# EAGLE board STEP800_r1_0_0 (EAGLE 9.6.2), part 1 of 3
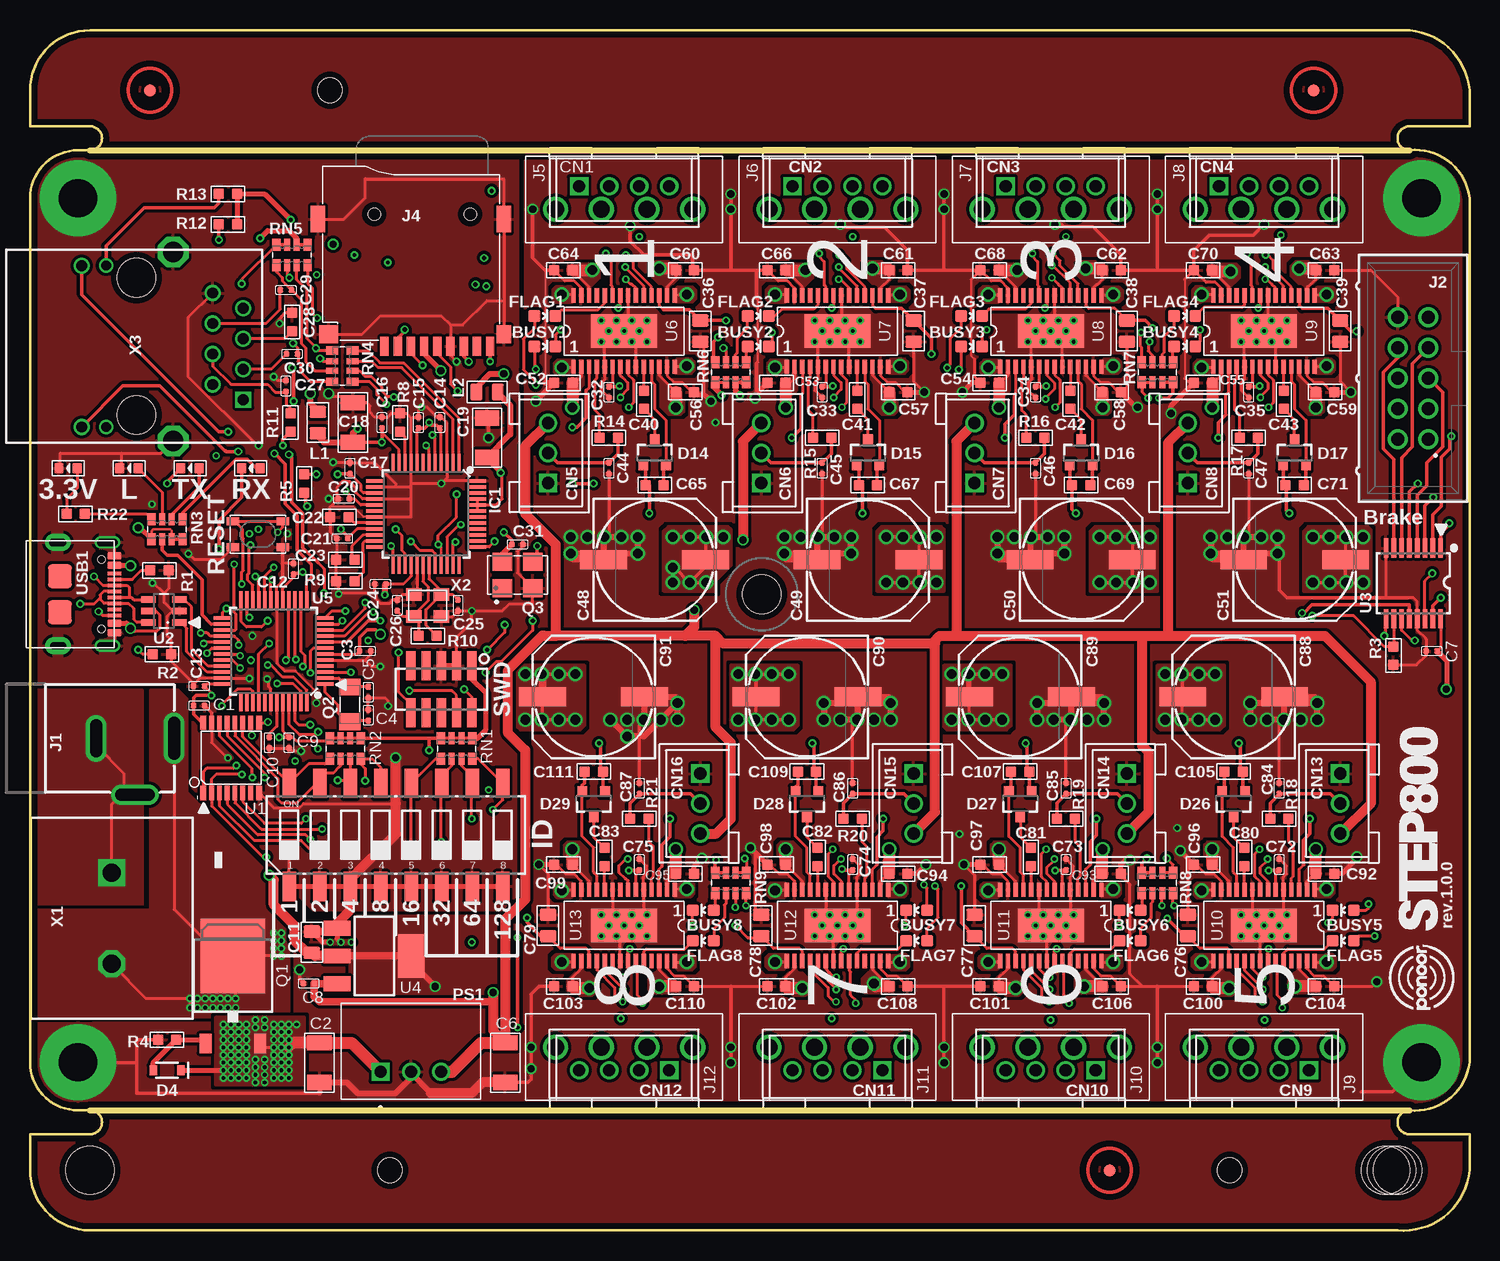
[diagram p3: board, top side]
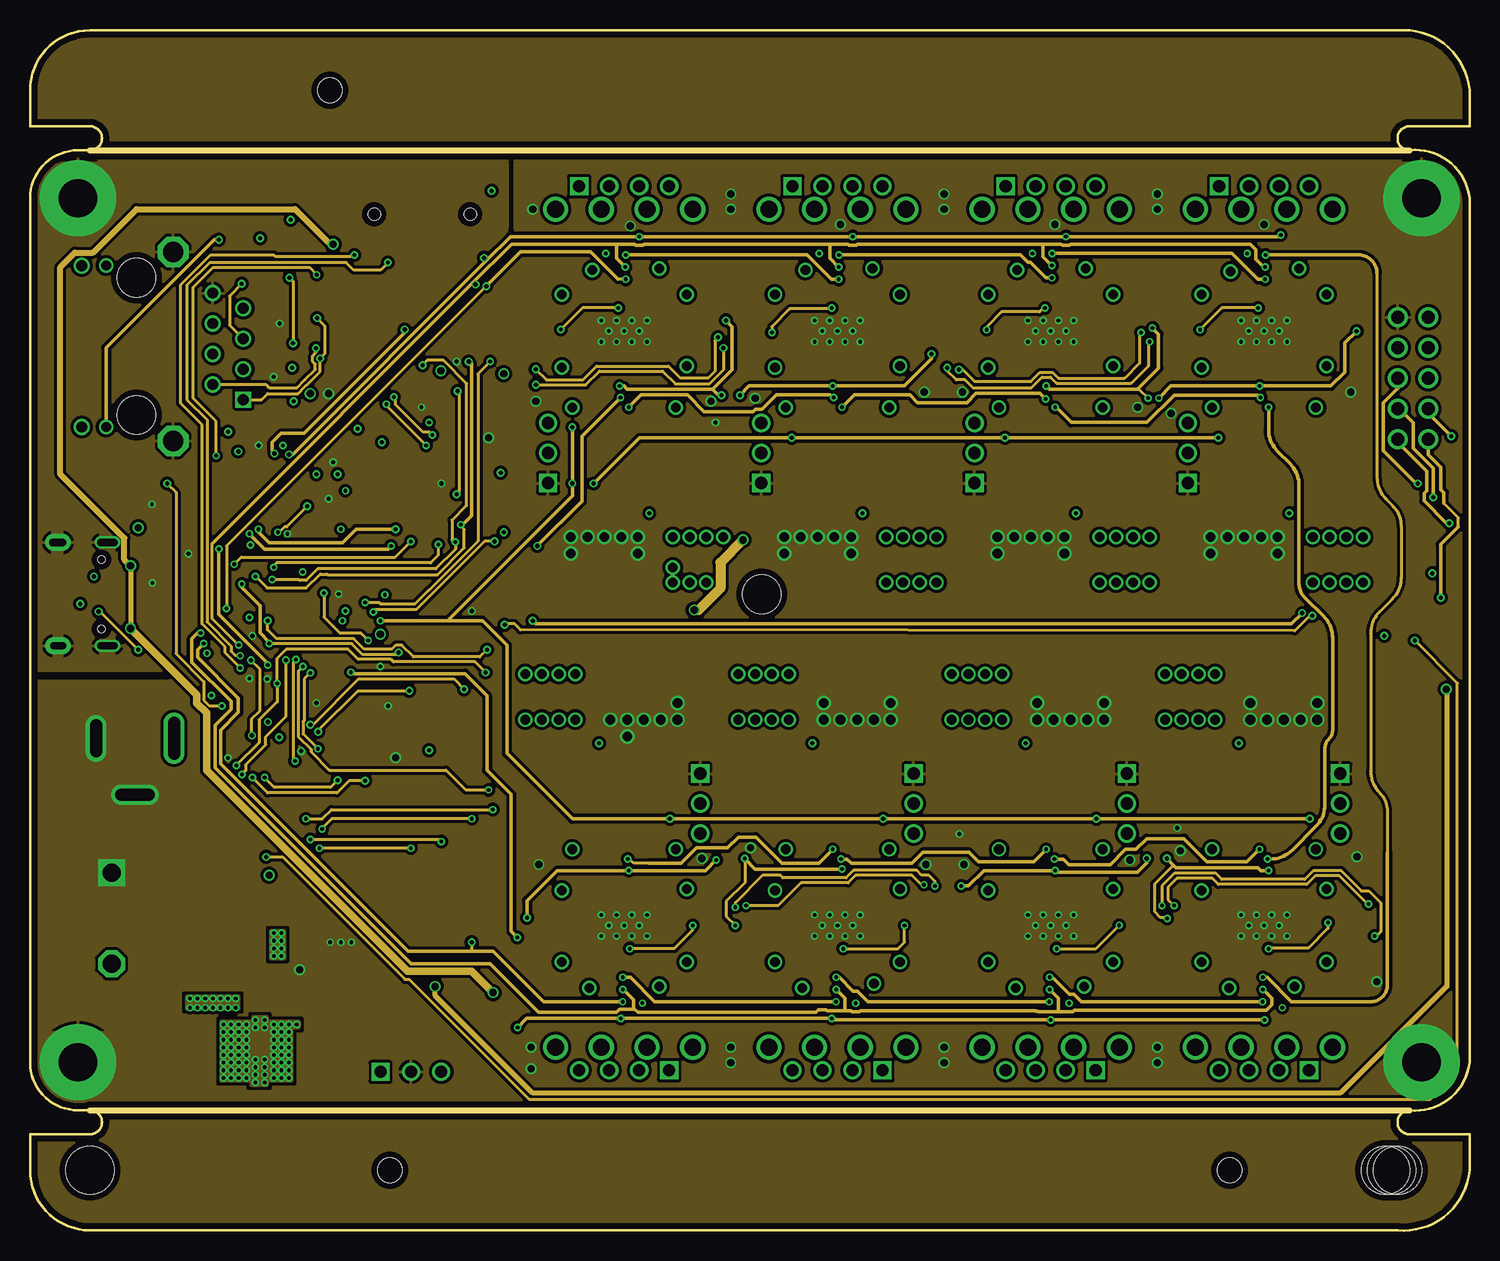
[diagram p4: board, inner layer Route2]
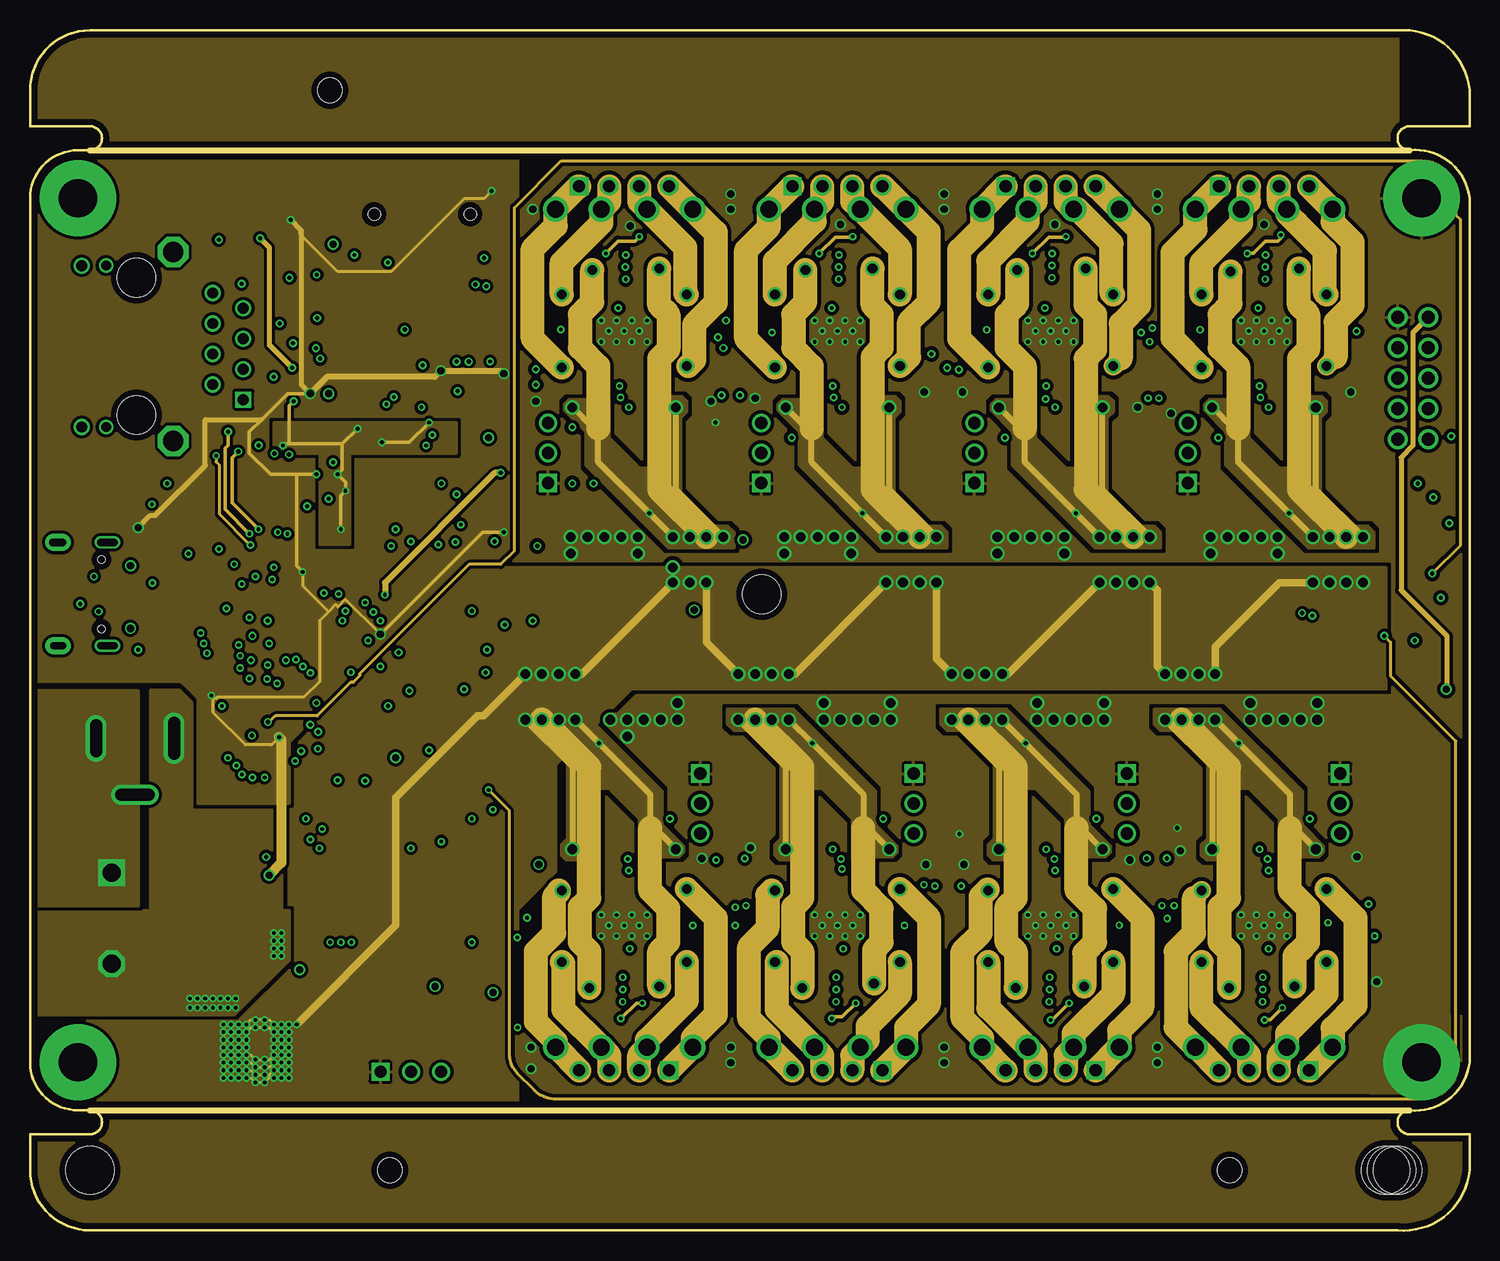
[diagram p5: board, inner layer Route15]
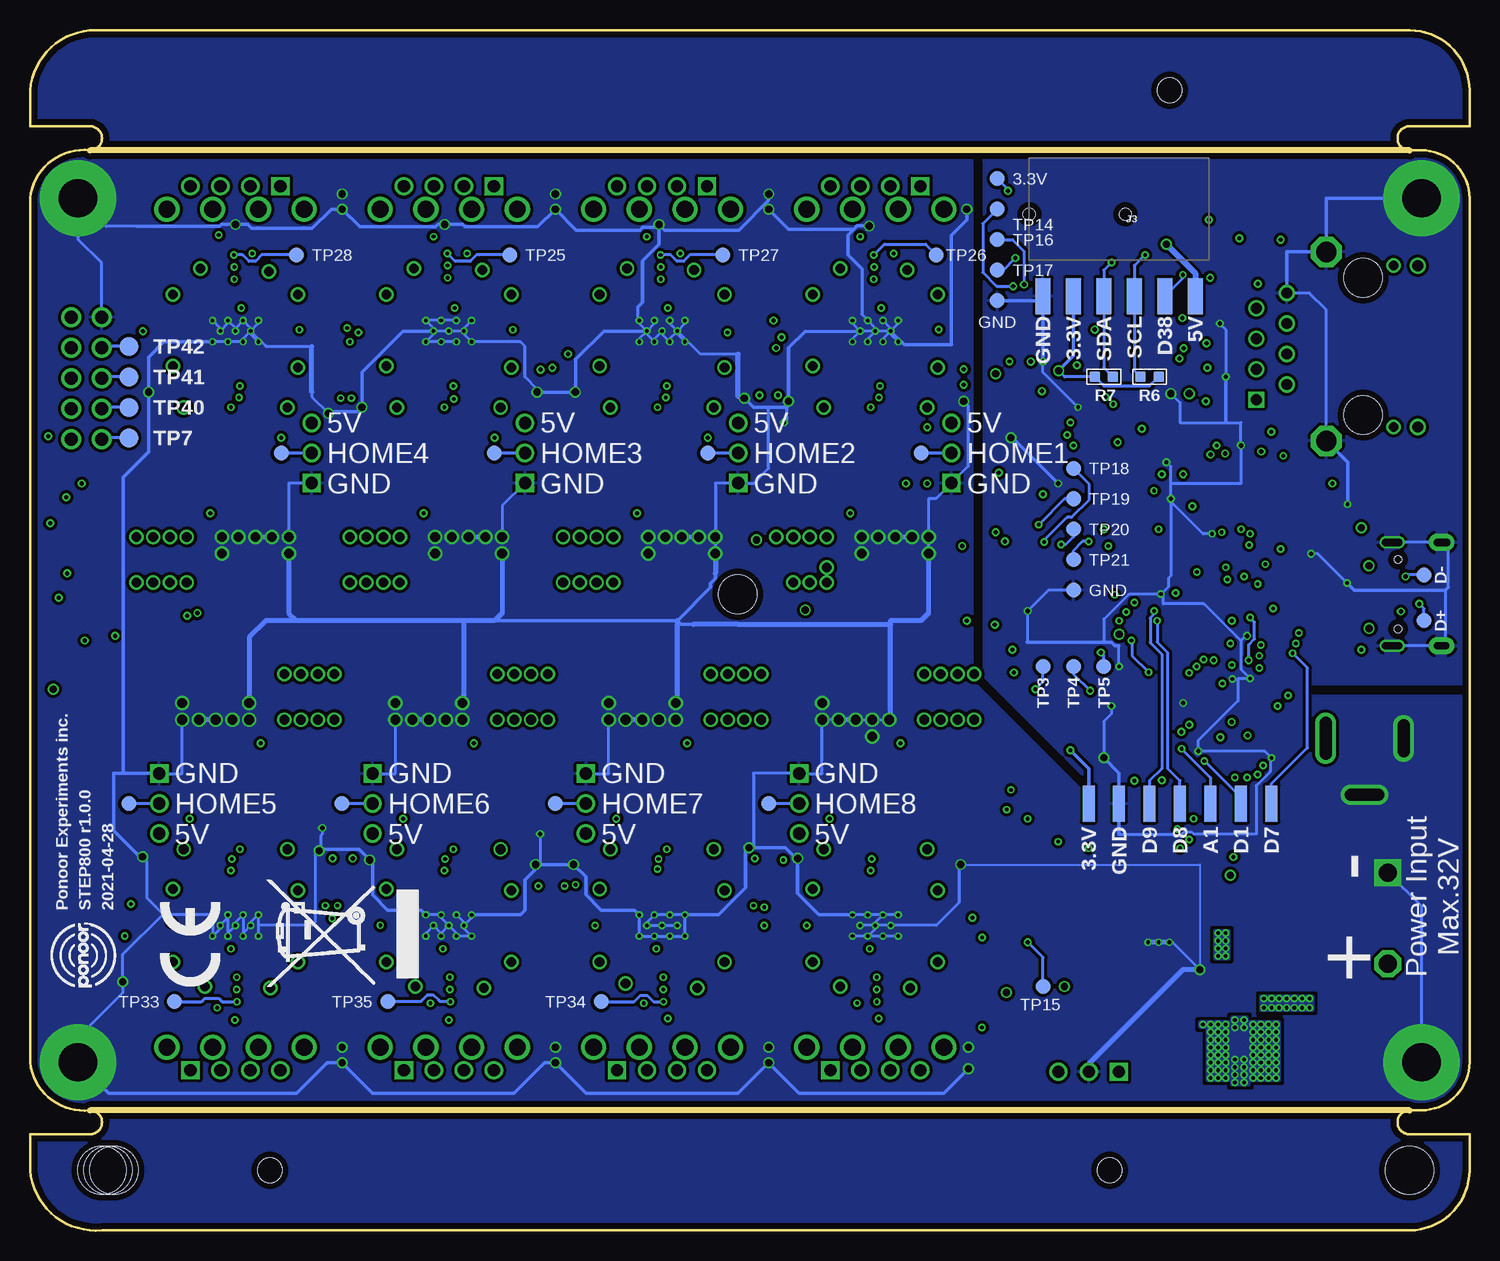
[diagram p6: board, bottom side, seen from below]

Size 120 x 100.05 mm. Coordinates in mm from the lower left corner, seen from the top.
Outline: 5,90.02 115,90.02
Outline: 5,10.02 115,10.02
Outline: 115,10.02 arc90 120,14.02 120,86.02 arc90 115,90.02
Outline: 5,90.02 arc90 6,91.02 arc90 5,92.02 0,92.02 0,95.02 arc-90 5,100.02 114,100.02 arc-90 120,95.02 120,92.02 115,92.02 arc90 114,91.02 arc90 115,90.02
Outline: 5,90.02 4,90.02 arc90 0,86.02 0,14.02 arc90 4,10.02 5,10.02
Outline: 5,10.02 arc-90 6,9.02 arc-90 5,8.02 0,8.02 0,5.02 arc90 5,0.02 114,0.02 arc90 120,5.02 120,8.02 115,8.02 arc-90 114,9.02 arc-90 115,10.02
Copper layers (1+2*15+16): Top 0.035mm / dielectric 1.6mm / Route2 0.035mm / dielectric 1.2mm / Route15 0.035mm / dielectric 0.2mm / Bottom 0.035mm
Design rules "PcbGoGo_4-layer_PCB_eagle_rule": minimum track width 6mil, minimum drill 12mil, track to track 6mil, track to pad 6mil, pad to pad 6mil, via to via 8mil, smd to smd 0mil, copper to edge 20mil, drill to drill 10mil, minimum pad ring 6mil, minimum via ring 6mil, stop-mask expansion 0mil, vias tented up to drill 100mil, thermal gap 10mil
Holes 2.05 mm at 25,95.02 100,5.02 30,5.02
Holes 4 mm at 5,5.02 114,5.02 113,5.02 113.5,5.02
Holes 3.2 mm at 61,53.02
tRestrict: area 8.3,93.3 to 11.7,96.7; area 88.3,3.3 to 91.7,6.7; area 105.3,93.3 to 108.7,96.7
bRestrict: 3 lines

## Footprints (pad centres in the part's own frame; a part is rotated, then mirrored left to right if it is on the bottom)
LED-0603 = smd 0.762 x 0.889: + -0.762,0; - 0.762,0
LED-0603' = smd 1 x 1: A 0,-0.877; C 0,0.877
C0402 = smd 0.5 x 0.5: 1 0,0.463; 2 0,-0.463
C1206 = smd 1.27 x 2.032: 1 -1.651,0; 2 1.651,0
C0805 = smd 1.397 x 1.016: 1 0,0.889; 2 0,-0.889
C0603 = smd 0.889 x 0.889: 1 0,0.762; 2 0,-0.762
NICHICON_D10 = smd 3.9 x 1.6: + 4.25,0; - -4.25,0
B4B-XASK-1 = drill 1.016 square: 1 -3.75,0 | drill 1.016: 2 -1.25,0; 3 1.25,0; 4 3.75,0
B3B-XASK-1 = drill 1.016 square: 1 -2.5,0 | drill 1.016: 2 0,0; 3 2.5,0
SOD-323 = smd 0.63 x 0.83: A 1.15,0; C -1.15,0
SOT23-3 = smd 0.8 x 0.9: 1 -0.95,-1; 2 0.95,-1; 3 0,1.1
FIDUCIAL-1X2 = smd 1 x 1: 1 0,0
TQFP48-LONG = smd 1.5 x 0.28: 1 -4.25,2.75; 2 -4.25,2.25; 3 -4.25,1.75; 4 -4.25,1.25; 5 -4.25,0.75; 6 -4.25,0.25; 7 -4.25,-0.25; 8 -4.25,-0.75; 9 -4.25,-1.25; 10 -4.25,-1.75; 11 -4.25,-2.25; 12 -4.25,-2.75; 25 4.25,-2.75; 26 4.25,-2.25; 27 4.25,-1.75; 28 4.25,-1.25; 29 4.25,-0.75; 30 4.25,-0.25; 31 4.25,0.25; 32 4.25,0.75; 33 4.25,1.25; 34 4.25,1.75; 35 4.25,2.25; 36 4.25,2.75 | smd 0.28 x 1.5: 13 -2.75,-4.25; 14 -2.25,-4.25; 15 -1.75,-4.25; 16 -1.25,-4.25; 17 -0.75,-4.25; 18 -0.25,-4.25; 19 0.25,-4.25; 20 0.75,-4.25; 21 1.25,-4.25; 22 1.75,-4.25; 23 2.25,-4.25; 24 2.75,-4.25; 37 2.75,4.25; 38 2.25,4.25; 39 1.75,4.25; 40 1.25,4.25; 41 0.75,4.25; 42 0.25,4.25; 43 -0.25,4.25; 44 -0.75,4.25; 45 -1.25,4.25; 46 -1.75,4.25; 47 -2.25,4.25; 48 -2.75,4.25
CTS-219-08 = smd 1.13 x 2.44: 1 -8.89,-4.3; 2 -6.35,-4.3; 3 -3.81,-4.3; 4 -1.27,-4.3; 5 1.27,-4.3; 6 3.81,-4.3; 7 6.35,-4.3; 8 8.89,-4.3; 9 8.89,4.3; 10 6.35,4.3; 11 3.81,4.3; 12 1.27,4.3; 13 -1.27,4.3; 14 -3.81,4.3; 15 -6.35,4.3; 16 -8.89,4.3
POWERJACK_SLOT = drill 1 pad 1.676: P$2 14,1.3; P$3 14,1.2; P$4 14,1.1; P$5 14,1; P$6 14,0.9; P$7 14,0.8; P$8 14,0.7; P$9 14,0.6; P$10 14,0.5; P$11 14,0.4; P$12 14,0.3; P$13 14,0.2; P$14 14,0.1; P$15 14,0; P$16 14,-0.1; P$17 14,-0.2; P$18 14,-0.3; P$19 14,-0.4; P$20 14,-0.5; P$21 14,-0.6; P$22 14,-0.7; P$23 14,-0.8; P$24 14,-0.9; P$25 14,-1; P$26 14,-1.1; P$27 14,-1.2; P$28 14,-1.3; P$33 11.9,-4.7; P$34 11.8,-4.7; P$35 11.7,-4.7; P$36 11.6,-4.7; P$37 11.5,-4.7; P$38 11.4,-4.7; P$39 11.3,-4.7; P$41 11.1,-4.7; P$42 11,-4.7; P$43 10.9,-4.7; P$44 10.8,-4.7; P$45 10.7,-4.7; P$46 10.6,-4.7; P$47 10.5,-4.7; P$48 10.4,-4.7; P$49 10.3,-4.7; P$50 10.2,-4.7; P$52 10,-4.7; P$53 9.9,-4.7; P$54 9.8,-4.7; P$56 9.6,-4.7; P$63 7.5,1.1; P$64 7.5,1; P$65 7.5,0.9; P$66 7.5,0.8; P$67 7.5,0.7; P$68 7.5,0.6; P$69 7.5,0.5; P$70 7.5,0.4; P$71 7.5,0.3; P$72 7.5,0.2; P$73 7.5,0.1; P$74 7.5,0; P$75 7.5,-0.1; P$76 7.5,-0.2; P$77 7.5,-0.3; P$78 7.5,-0.4; P$79 7.5,-0.5; P$80 7.5,-0.6; P$81 7.5,-0.7; P$82 7.5,-0.8; P$83 7.5,-0.9; P$84 7.5,-1; P$85 7.5,-1.1 | drill 1: P$40 11.2,-4.7; P$51 10.1,-4.7; P$55 9.7,-4.7
61201021621 = drill 1.1: 1 -5.08,-1.27; 2 -5.08,1.27; 3 -2.54,-1.27; 4 -2.54,1.27; 5 0,-1.27; 6 0,1.27; 7 2.54,-1.27; 8 2.54,1.27; 9 5.08,-1.27; 10 5.08,1.27
1X06-SMD-FEMALE = smd 1.25 x 3: 1 6.35,3.425; 2 3.81,3.425; 3 1.27,3.425; 4 -1.27,3.425; 5 -3.81,3.425; 6 -6.35,3.425
TF-115K = smd 0.7 x 1.6: 1 2.2,0; 2 1.1,0; 3 0,0; 4 -1.1,0; 5 -2.2,0; 6 -3.3,0; 7 -4.4,0; 8 -5.5,0; CD -6.6,0 | smd 1.6 x 1.5: SHIELD1 6.85,-1 | smd 1.2 x 2.2: SHIELD2 7.75,-10.6; SHIELD4 -7.75,-10.6 | smd 1.2 x 1.5: SHIELD3 -7.75,-1 | hole 1: -4.95,-11; 3.05,-11
691321300004 = drill 1.4: 1 -5.715,0; 2 -1.905,0; 3 1.905,0; 4 5.715,0
L0805 = smd 1.016 x 1.397: 1 -0.889,0; 2 0.889,0
CONV_P78E05-1000 = drill 1 square: 1 -2.54,0 | drill 1: 2 0,0; 3 2.54,0
TO252 = smd 1 x 1.6: 1 -2.28,-4.8; 2 2.28,-4.8 | smd 5.4 x 6.2: 3 0,2.5
FC-135 = smd 1.4 x 1.8: P$1 -1.45,0; P$2 1.45,0
SG5032 = smd 1.5 x 1.6: 1 -1.1,1.27; 2 -1.1,-1.27; 3 1.1,-1.27; 4 1.1,1.27
R0603 = smd 0.889 x 0.889: 1 0,0.762; 2 0,-0.762
SKRP = smd 1.05 x 0.65: P$1 -2.075,1.075; P$2 2.075,1.075; P$3 -2.075,-1.075; P$4 2.075,-1.075
CAY16_LONG_W = smd 0.7 x 1: 1 -1.3,-0.85; 4 1.3,-0.85; 5 1.3,0.85; 8 -1.3,0.85 | smd 0.5 x 1: 2 -0.4,-0.85; 3 0.4,-0.85; 6 0.4,0.85; 7 -0.4,0.85
STANDOFF-ELECTRICAL = drill 3.2 pad 6.35: P1 0,0
20021121-00010C4LF = smd 0.762 x 2.388: P$1 -2.54,-1.956; P$2 -2.54,1.956; P$3 -1.27,-1.956; P$4 -1.27,1.956; P$5 0,-1.956; P$6 0,1.956; P$7 1.27,-1.956; P$8 1.27,1.956; P$9 2.54,-1.956; P$10 2.54,1.956
PAD.03X.05 = smd 1.27 x 1.27: P$1 0,0
TESTPOINT_3X1 = smd 3 x 1: P$1 0,0
TESTPOINT_D1.6 = smd 1.6 x 1.6: 1 0,0
TSSOP16 = smd 0.5 x 1.2: 1 -2.325,-2.925; 8 2.325,-2.925; 9 2.325,2.925; 16 -2.325,2.925 | smd 0.4 x 1.2: 2 -1.625,-2.925; 3 -0.975,-2.925; 4 -0.325,-2.925; 5 0.325,-2.925; 6 0.975,-2.925; 7 1.625,-2.925; 10 1.625,2.925; 11 0.975,2.925; 12 0.325,2.925; 13 -0.325,2.925; 14 -0.975,2.925; 15 -1.625,2.925
SOT23-6L = smd 0.55 x 1.2: 1 -0.95,-1.3; 2 0,-1.3; 3 0.95,-1.3; 4 0.95,1.3; 5 0,1.3; 6 -0.95,1.3
TSSOP16' = smd 0.4 x 1.6: 1 -2.225,-2.85; 2 -1.575,-2.85; 3 -0.925,-2.85; 4 -0.275,-2.85; 5 0.375,-2.85; 6 1.025,-2.85; 7 1.675,-2.85; 8 2.325,-2.85; 9 2.325,3.05; 10 1.675,3.05; 11 1.025,3.05; 12 0.375,3.05; 13 -0.275,3.05; 14 -0.925,3.05; 15 -1.575,3.05; 16 -2.225,3.05
SOT223 = smd 1.219 x 2.235: 1 -2.311,-3.099; 2 0,-3.099; 3 2.311,-3.099 | smd 3.6 x 2.2: 4 0,3.099
TQFP-48 = smd 1.5 x 0.28: 1 -4.25,2.75; 2 -4.25,2.25; 3 -4.25,1.75; 4 -4.25,1.25; 5 -4.25,0.75; 6 -4.25,0.25; 7 -4.25,-0.25; 8 -4.25,-0.75; 9 -4.25,-1.25; 10 -4.25,-1.75; 11 -4.25,-2.25; 12 -4.25,-2.75; 25 4.25,-2.75; 26 4.25,-2.25; 27 4.25,-1.75; 28 4.25,-1.25; 29 4.25,-0.75; 30 4.25,-0.25; 31 4.25,0.25; 32 4.25,0.75; 33 4.25,1.25; 34 4.25,1.75; 35 4.25,2.25; 36 4.25,2.75 | smd 0.28 x 1.5: 13 -2.75,-4.25; 14 -2.25,-4.25; 15 -1.75,-4.25; 16 -1.25,-4.25; 17 -0.75,-4.25; 18 -0.25,-4.25; 19 0.25,-4.25; 20 0.75,-4.25; 21 1.25,-4.25; 22 1.75,-4.25; 23 2.25,-4.25; 24 2.75,-4.25; 37 2.75,4.25; 38 2.25,4.25; 39 1.75,4.25; 40 1.25,4.25; 41 0.75,4.25; 42 0.25,4.25; 43 -0.25,4.25; 44 -0.75,4.25; 45 -1.25,4.25; 46 -1.75,4.25; 47 -2.25,4.25; 48 -2.75,4.25
HTSSOP28_VIA = smd 0.36 x 1.19: 1 -4.225,-2.97; 2 -3.575,-2.97; 3 -2.925,-2.97; 4 -2.275,-2.97; 5 -1.625,-2.97; 6 -0.975,-2.97; 7 -0.325,-2.97; 8 0.325,-2.97; 9 0.975,-2.97; 10 1.625,-2.97; 11 2.275,-2.97; 12 2.925,-2.97; 13 3.575,-2.97; 14 4.225,-2.97; 15 4.225,2.97; 16 3.575,2.97; 17 2.925,2.97; 18 2.275,2.97; 19 1.625,2.97; 20 0.975,2.97; 21 0.325,2.97; 22 -0.325,2.97; 23 -0.975,2.97; 24 -1.625,2.97; 25 -2.275,2.97; 26 -2.925,2.97; 27 -3.575,2.97; 28 -4.225,2.97 | smd 5.5 x 2.8: 29 0,0 | drill 0.3: VIA1 -1.905,0.889; VIA2 -0.635,0.889; VIA3 0.635,0.889; VIA4 1.905,0.889; VIA5 -1.27,0; VIA6 0,0; VIA7 1.27,0; VIA8 -1.905,-0.889; VIA9 -0.635,-0.889; VIA10 0.635,-0.889; VIA11 1.905,-0.889
USB-C_USB2.0-TYPE-C = smd 1.2 x 0.6: A1_B12 0.05,3.2; A4_B9 0.05,2.4; B1_A12 0.05,-3.2; B4_A9 0.05,-2.4 | smd 1.2 x 0.3: A5 0.05,1.25; A6 0.05,0.25; A7 0.05,-0.25; A8 0.05,-1.25; B5 0.05,-1.75; B6 0.05,-0.75; B7 0.05,0.75; B8 0.05,1.75 | smd 2 x 2: S5 -4.5,1.5; S6 -4.5,-1.5 | drill 0.6 pad 1.27: S7 -5.1,4.32 | drill 0.6 pad 1.422: S8 -5,4.32; S9 -4.9,4.32; S10 -4.8,4.32; S11 -4.7,4.32; S12 -4.6,4.32; S13 -4.5,4.32; S14 -4.4,4.32; S15 -4.3,4.32; S29 -5,-4.3; S30 -4.9,-4.3; S31 -4.8,-4.3; S32 -4.7,-4.3; S33 -4.6,-4.3; S34 -4.5,-4.3; S35 -4.4,-4.3; S36 -4.3,-4.3 | drill 0.6 pad 1: S16 -1.1,4.32; S17 -1,4.32; S18 -0.9,4.32; S19 -0.8,4.32; S20 -0.7,4.32; S21 -0.6,4.32; S22 -0.5,4.32; S23 -0.4,4.32; S24 -0.3,4.32; S25 -0.2,4.32; S26 -0.1,4.32; S27 0,4.32; S37 -1.1,-4.3; S38 -1,-4.3; S39 -0.9,-4.3; S40 -0.8,-4.3; S41 -0.7,-4.3; S42 -0.6,-4.3; S43 -0.5,-4.3; S44 -0.4,-4.3; S45 -0.3,-4.3; S46 -0.2,-4.3; S47 -0.1,-4.3; S48 0,-4.3 | hole 0.6: -1.05,-2.89; -1.05,2.89
WJ25C-B-7.62-2P = drill 1.5 square: P$1 -3.81,0 | drill 1.5 octagon: P$2 3.81,0
CRYSTAL-3.2-2.5 = smd 1.3 x 1.05: 1 -1.15,-0.925; 2 1.15,-0.925; 3 1.15,0.925; 4 -1.15,0.925
HR871181A = drill 0.9 square: 1 -4.44,-8.89 | drill 0.9: 2 -3.175,-6.35; 3 -1.905,-8.89; 4 -0.635,-6.35; 5 0.635,-8.89; 6 1.905,-6.35; 7 3.175,-8.89; 8 4.445,-6.35; 10 -6.725,4.57; 12 6.725,4.57 | drill 0.8: 9 -6.725,2.54; 11 6.725,2.54 | drill 1.7 octagon: SHIELD1 -7.875,-3.05; SHIELD2 7.875,-3.05 | hole 3.2: -5.715,0; 5.715,0

## Placement (x,y rotation side)
3.3V  GREEN-0603  [LED-0603]  3.17,63.52 180 top
BUSY1  GREEN  [LED-0603']  42.93,73.68 270 top
BUSY2  GREEN  [LED-0603']  60.71,73.68 270 top
BUSY3  GREEN  [LED-0603']  78.49,73.68 270 top
BUSY4  GREEN  [LED-0603']  96.27,73.68 270 top
BUSY5  GREEN  [LED-0603']  109.47,26.69 90 top
BUSY6  GREEN  [LED-0603']  91.69,26.69 90 top
BUSY7  GREEN  [LED-0603']  73.91,26.69 90 top
BUSY8  GREEN  [LED-0603']  56.13,26.69 90 top
C1  100nf  [C0402]  14.09,43.74 90 top
C2  10uF/50V  [C1206]  24.13,13.99 90 top
C3  100nf  [C0402]  27.94,48.28 90 top
C4  22pF  [C0402]  28.19,42.95 0 top
C5  22pF  [C0402]  28.19,44.85 0 top
C6  10uF/10V  [C1206]  39.62,13.99 90 top
C7  100nf  [C0402]  116.84,48.28 270 top
C8  100nf  [C0402]  23.24,20.6 270 top
C9  100nf  [C0402]  21.59,40.66 0 top
C10  100nf  [C0402]  19.94,40.66 0 top
C11  10uF/10V  [C0805]  23.5,24.03 0 top
C12  100nf  [C0402]  21.97,55.14 180 top
C13  100nf  [C0402]  14.1,45.36 270 top
C14  100nf  [C0402]  34.16,67.33 180 top
C15  100nf  [C0402]  32.38,67.33 180 top
C16  100nf  [C0402]  29.34,67.33 180 top
C17  100nf  [C0402]  26.67,63.52 180 top
C18  47uF/6.3V  [C1206]  26.92,67.33 90 top
C19  47uF/6.3V  [C1206]  38.1,66.06 90 top
C20  100nf  [C0402]  26.16,60.98 270 top
C21  100nf  [C0402]  26.04,57.68 270 top
C22  4.7uF / 6.3V  [C0603]  25.78,59.46 90 top
C23  10nf  [C0603]  26.29,55.9 90 top
C24  100nf  [C0402]  29.21,53.87 90 top
C25  22pF  [C0402]  35.69,52.09 0 top
C26  22pF  [C0402]  30.61,52.09 180 top
C27  22nF/25V  [C0402]  21.34,70.38 180 top
C28  10nf  [C0603]  21.84,75.71 180 top
C29  6.8nF  [C0402]  21.34,78.38 270 top
C30  6.8nF  [C0402]  21.84,73.05 270 top
C31  100nf  [C0402]  40.64,57.17 270 top
C32  100nf  [C0402]  48.26,69.87 0 top
C33  100nf  [C0402]  66.04,69.87 0 top
C34  100nf  [C0402]  83.82,69.87 0 top
C35  100nf  [C0402]  101.6,69.87 0 top
C36  10uF / 10V  [C0805]  55.88,74.95 180 top
C37  10uF / 10V  [C0805]  73.66,74.95 180 top
C38  10uF / 10V  [C0805]  91.44,74.95 180 top
C39  10uF / 10V  [C0805]  109.22,74.95 180 top
C40  10nF  [C0603]  51.18,69.24 180 top
C41  10nF  [C0603]  68.96,69.24 180 top
C42  10nF  [C0603]  86.74,69.24 180 top
C43  10nF  [C0603]  104.52,69.24 180 top
C44  10nf  [C0402]  48.26,63.52 180 top
C45  100nF / 25V  [C0402]  66.04,63.52 180 top
C46  100nF / 25V  [C0402]  83.82,63.52 180 top
C47  100nF / 25V  [C0402]  101.6,63.52 180 top
C48  330uF, 35V  [NICHICON_D10]  52.07,55.9 0 top
C49  330uF, 35V  [NICHICON_D10]  69.85,55.9 0 top
C50  330uF, 35V  [NICHICON_D10]  87.63,55.9 0 top
C51  330uF, 35V  [NICHICON_D10]  105.41,55.9 0 top
C52  100nf  [C0603]  44.45,70.63 90 top
C53  100nf  [C0603]  62.23,70.63 90 top
C54  100nf  [C0603]  80.01,70.63 90 top
C55  100nf  [C0603]  97.79,70.63 90 top
C56  100nf  [C0603]  54.61,69.87 270 top
C57  100nf  [C0603]  72.39,69.87 270 top
C58  100nf  [C0603]  90.17,69.87 270 top
C59  100nf  [C0603]  107.95,69.87 270 top
C60  100nf  [C0603]  54.61,80.03 270 top
C61  100nf  [C0603]  72.39,80.03 270 top
C62  100nf  [C0603]  90.17,80.03 270 top
C63  100nf  [C0603]  107.95,80.03 270 top
C64  100nf  [C0603]  44.45,80.03 90 top
C65  220nf  [C0603]  52.07,62.13 270 top
C66  100nf  [C0603]  62.23,80.03 90 top
C67  220nf  [C0603]  69.85,62.13 270 top
C68  100nf  [C0603]  80.01,80.03 90 top
C69  220nf  [C0603]  87.63,62.13 270 top
C70  100nf  [C0603]  97.79,80.03 90 top
C71  220nf  [C0603]  105.41,62.13 270 top
C72  100nf  [C0402]  104.14,30.5 180 top
C73  100nf  [C0402]  86.36,30.5 180 top
C74  100nf  [C0402]  68.58,30.5 180 top
C75  100nf  [C0402]  50.8,30.5 180 top
C76  10uF / 10V  [C0805]  96.52,25.42 0 top
C77  10uF / 10V  [C0805]  78.74,25.42 0 top
C78  10uF / 10V  [C0805]  60.96,25.42 0 top
C79  10uF / 10V  [C0805]  43.18,25.42 0 top
C80  10nF  [C0603]  101.22,31.14 0 top
C81  10nF  [C0603]  83.44,31.14 0 top
C82  10nF  [C0603]  65.66,31.14 0 top
C83  10nF  [C0603]  47.88,31.14 0 top
C84  100nF / 25V  [C0402]  104.14,36.85 0 top
C85  100nF / 25V  [C0402]  86.36,36.85 0 top
C86  100nF / 25V  [C0402]  68.58,36.85 0 top
C87  100nF / 25V  [C0402]  50.8,36.85 0 top
C88  330uF, 35V  [NICHICON_D10]  100.33,44.47 180 top
C89  330uF, 35V  [NICHICON_D10]  82.55,44.47 180 top
C90  330uF, 35V  [NICHICON_D10]  64.77,44.47 180 top
C91  330uF, 35V  [NICHICON_D10]  46.99,44.47 180 top
C92  100nf  [C0603]  107.95,29.74 270 top
C93  100nf  [C0603]  90.17,29.74 270 top
C94  100nf  [C0603]  72.39,29.74 270 top
C95  100nf  [C0603]  54.61,29.74 270 top
C96  100nf  [C0603]  97.79,30.5 90 top
C97  100nf  [C0603]  80.01,30.5 90 top
C98  100nf  [C0603]  62.23,30.5 90 top
C99  100nf  [C0603]  44.45,30.5 90 top
C100  100nf  [C0603]  97.79,20.34 90 top
C101  100nf  [C0603]  80.01,20.34 90 top
C102  100nf  [C0603]  62.23,20.34 90 top
C103  100nf  [C0603]  44.45,20.34 90 top
C104  100nf  [C0603]  107.95,20.34 270 top
C105  220nf  [C0603]  100.33,38.25 90 top
C106  100nf  [C0603]  90.17,20.34 270 top
C107  220nf  [C0603]  82.55,38.25 90 top
C108  100nf  [C0603]  72.39,20.34 270 top
C109  220nf  [C0603]  64.77,38.25 90 top
C110  100nf  [C0603]  54.61,20.34 270 top
C111  220nf  [C0603]  46.99,38.25 90 top
CN1  [B4B-XASK-1]  49.53,87.02 0 top
CN2  [B4B-XASK-1]  67.31,87.02 0 top
CN3  [B4B-XASK-1]  85.09,87.02 0 top
CN4  [B4B-XASK-1]  102.87,87.02 0 top
CN5  [B3B-XASK-1]  43.18,64.79 90 top
CN6  [B3B-XASK-1]  60.96,64.79 90 top
CN7  [B3B-XASK-1]  78.74,64.79 90 top
CN8  [B3B-XASK-1]  96.52,64.79 90 top
CN9  [B4B-XASK-1]  102.87,13.36 180 top
CN10  [B4B-XASK-1]  85.09,13.36 180 top
CN11  [B4B-XASK-1]  67.31,13.36 180 top
CN12  [B4B-XASK-1]  49.53,13.36 180 top
CN13  [B3B-XASK-1]  109.22,35.58 270 top
CN14  [B3B-XASK-1]  91.44,35.58 270 top
CN15  [B3B-XASK-1]  73.66,35.58 270 top
CN16  [B3B-XASK-1]  55.88,35.58 270 top
D4  5.1V  [SOD-323]  11.43,13.36 180 top
D14  BAV99  [SOT23-3]  52.07,64.79 0 top
D15  BAV99  [SOT23-3]  69.85,64.79 0 top
D16  BAV99  [SOT23-3]  87.63,64.79 0 top
D17  BAV99  [SOT23-3]  105.41,64.79 0 top
D26  BAV99  [SOT23-3]  100.33,35.58 180 top
D27  BAV99  [SOT23-3]  82.55,35.58 180 top
D28  BAV99  [SOT23-3]  64.77,35.58 180 top
D29  BAV99  [SOT23-3]  46.99,35.58 180 top
FD1  FIDUCIAL1X2  [FIDUCIAL-1X2]  90,5.02 0 top
FD2  FIDUCIAL1X2  [FIDUCIAL-1X2]  10,95.02 0 top
FD3  FIDUCIAL1X2  [FIDUCIAL-1X2]  107,95.02 0 top
FLAG1  RED  [LED-0603']  42.93,76.22 270 top
FLAG2  RED  [LED-0603']  60.71,76.22 270 top
FLAG3  RED  [LED-0603']  78.49,76.22 270 top
FLAG4  RED  [LED-0603']  96.27,76.22 270 top
FLAG5  RED  [LED-0603']  109.47,24.15 90 top
FLAG6  RED  [LED-0603']  91.69,24.15 90 top
FLAG7  RED  [LED-0603']  73.91,24.15 90 top
FLAG8  RED  [LED-0603']  56.13,24.15 90 top
IC1  0982_W5500LONG  [TQFP48-LONG]  33.02,59.71 270 top
ID  219-08  [CTS-219-08]  30.51,32.97 0 top
J1  POWERJACK  [POWERJACK_SLOT]  -2,41.02 0 top
J2  [61201021621]  115.3,71.02 90 top
J3  CONN_06_SMD_FEMALE  [1X06-SMD-FEMALE]  29.21,81.3 180 bottom
J4  SDCARD_SLOT_TF-115K  [TF-115K]  31.75,73.68 180 top
J5  691321300004  [691321300004]  49.53,85.11 0 top
J6  691321300004  [691321300004]  67.31,85.11 0 top
J7  691321300004  [691321300004]  85.09,85.11 0 top
J8  691321300004  [691321300004]  102.87,85.11 0 top
J9  691321300004  [691321300004]  102.87,15.26 180 top
J10  691321300004  [691321300004]  85.09,15.26 180 top
J11  691321300004  [691321300004]  67.31,15.26 180 top
J12  691321300004  [691321300004]  49.53,15.26 180 top
L  BLUE-0603  [LED-0603]  8.26,63.52 180 top
L1  330R-1500MA  [L0805]  24,67.33 270 top
L2  330R-1500MA  [L0805]  38.1,69.87 0 top
PS1  P78E05-1000  [CONV_P78E05-1000]  31.75,13.23 0 top
Q1  FDD4141TO252  [TO252]  16.92,20.39 0 top
Q2  32.768kHz  [FC-135]  26.67,43.84 270 top
Q3  [SG5032]  40.64,54.63 90 top
R1  5.1k  [R0603]  10.79,55.01 270 top
R2  5.1k  [R0603]  11,48.02 90 top
R3  100K 1/10W  [R0603]  113.67,47.9 180 top
R4  100K 1/10W  [R0603]  11.43,15.9 90 top
R5  100K 1/10W  [R0603]  22.86,62.25 180 top
R6  4.7K  [R0603]  26.67,71.14 90 bottom
R7  4.7K  [R0603]  30.48,71.14 270 bottom
R8  12.4K  [R0603]  30.86,67.33 0 top
R9  100K 1/10W  [R0603]  26.29,54.12 90 top
R10  1M 1/10W  [R0603]  33.15,49.55 270 top
R11  10R  [R0603]  21.72,67.33 0 top
R12  330R  [R0603]  16.51,83.84 90 top
R13  330R  [R0603]  16.51,86.38 90 top
R14  100R  [R0603]  48.26,66.06 90 top
R15  100R  [R0603]  66.04,66.06 90 top
R16  100R  [R0603]  83.82,66.06 90 top
R17  100R  [R0603]  101.6,66.06 90 top
R18  100R  [R0603]  104.14,34.31 270 top
R19  100R  [R0603]  86.36,34.31 270 top
R20  100R  [R0603]  68.58,34.31 270 top
R21  100R  [R0603]  50.8,34.31 270 top
R22  330R  [R0603]  3.81,59.71 90 top
RESET  SWITCH-SPST-2  [SKRP]  19,58.02 0 top
RN1  100k  [CAY16_LONG_W]  35.56,40.15 0 top
RN2  100k  [CAY16_LONG_W]  26.29,40.15 0 top
RN3  330  [CAY16_LONG_W]  11.43,58.44 180 top
RN4  33  [CAY16_LONG_W]  26.04,72.03 270 top
RN5  49.9  [CAY16_LONG_W]  21.84,81.3 180 top
RN6  330  [CAY16_LONG_W]  58.42,71.52 0 top
RN7  330  [CAY16_LONG_W]  93.98,71.52 0 top
RN8  330  [CAY16_LONG_W]  93.98,28.98 180 top
RN9  330  [CAY16_LONG_W]  58.42,28.98 180 top
RX  RED-0603  [LED-0603]  18.41,63.52 180 top
S2  STANDOFF_ELECTRICAL  [STANDOFF-ELECTRICAL]  116,14.02 0 top
S3  STANDOFF_ELECTRICAL  [STANDOFF-ELECTRICAL]  116,86.02 0 top
S4  STANDOFF_ELECTRICAL  [STANDOFF-ELECTRICAL]  4,86.02 0 top
S5  STANDOFF_ELECTRICAL  [STANDOFF-ELECTRICAL]  4,14.02 0 top
SWD  CORTEX_DEBUG_SMT  [20021121-00010C4LF]  34.29,45.11 180 top
TP1  TEST-POINT3X5  [PAD.03X.05]  3.81,54.63 0 bottom
TP2  TEST-POINT3X5  [PAD.03X.05]  3.81,50.82 0 bottom
TP3  TEST-POINT3X5  [PAD.03X.05]  35.56,47.01 270 bottom
TP4  TEST-POINT3X5  [PAD.03X.05]  33.02,47.01 270 bottom
TP5  TEST-POINT3X5  [PAD.03X.05]  30.48,47.01 270 bottom
TP6  TESTPOINT_3X1  [TESTPOINT_3X1]  16.51,35.58 270 bottom
TP7  TESTPOINT_D1.6  [TESTPOINT_D1.6]  111.76,66.06 0 bottom
TP8  TESTPOINT_3X1  [TESTPOINT_3X1]  19.05,35.58 270 bottom
TP9  TESTPOINT_3X1  [TESTPOINT_3X1]  21.59,35.58 270 bottom
TP10  TESTPOINT_3X1  [TESTPOINT_3X1]  24.13,35.58 270 bottom
TP11  TESTPOINT_3X1  [TESTPOINT_3X1]  26.67,35.58 270 bottom
TP12  TESTPOINT_3X1  [TESTPOINT_3X1]  31.75,35.58 270 bottom
TP13  TESTPOINT_3X1  [TESTPOINT_3X1]  29.21,35.58 270 bottom
TP14  TEST-POINT3X5  [PAD.03X.05]  39.37,85.11 0 bottom
TP15  TEST-POINT3X5  [PAD.03X.05]  35.56,20.34 0 bottom
TP16  TEST-POINT3X5  [PAD.03X.05]  39.37,82.57 0 bottom
TP17  TEST-POINT3X5  [PAD.03X.05]  39.37,80.03 0 bottom
TP18  TEST-POINT3X5  [PAD.03X.05]  33.02,63.52 0 bottom
TP19  TEST-POINT3X5  [PAD.03X.05]  33.02,60.98 0 bottom
TP20  TEST-POINT3X5  [PAD.03X.05]  33.02,58.44 0 bottom
TP21  TEST-POINT3X5  [PAD.03X.05]  33.02,55.9 0 bottom
TP22  TEST-POINT3X5  [PAD.03X.05]  39.37,87.65 0 bottom
TP23  TEST-POINT3X5  [PAD.03X.05]  39.37,77.49 0 bottom
TP24  TEST-POINT3X5  [PAD.03X.05]  33.02,53.36 0 bottom
TP25  TEST-POINT3X5  [PAD.03X.05]  80.01,81.3 0 bottom
TP26  TEST-POINT3X5  [PAD.03X.05]  44.45,81.3 0 bottom
TP27  TEST-POINT3X5  [PAD.03X.05]  62.23,81.3 0 bottom
TP28  TEST-POINT3X5  [PAD.03X.05]  97.79,81.3 0 bottom
TP29  TEST-POINT3X5  [PAD.03X.05]  99.06,64.79 0 bottom
TP30  TEST-POINT3X5  [PAD.03X.05]  45.72,64.79 0 bottom
TP31  TEST-POINT3X5  [PAD.03X.05]  63.5,64.79 0 bottom
TP32  TEST-POINT3X5  [PAD.03X.05]  81.28,64.79 0 bottom
TP33  TEST-POINT3X5  [PAD.03X.05]  107.95,19.07 0 bottom
TP34  TEST-POINT3X5  [PAD.03X.05]  72.39,19.07 0 bottom
TP35  TEST-POINT3X5  [PAD.03X.05]  90.17,19.07 0 bottom
TP36  TEST-POINT3X5  [PAD.03X.05]  111.76,35.58 0 bottom
TP37  TEST-POINT3X5  [PAD.03X.05]  93.98,35.58 180 bottom
TP38  TEST-POINT3X5  [PAD.03X.05]  76.2,35.58 0 bottom
TP39  TEST-POINT3X5  [PAD.03X.05]  58.42,35.58 0 bottom
TP40  TESTPOINT_D1.6  [TESTPOINT_D1.6]  111.76,68.6 0 bottom
TP41  TESTPOINT_D1.6  [TESTPOINT_D1.6]  111.76,71.14 0 bottom
TP42  TESTPOINT_D1.6  [TESTPOINT_D1.6]  111.76,73.68 0 bottom
TX  YELLOW-0603  [LED-0603]  13.34,63.52 180 top
U1  74HC165PW  [TSSOP16]  16.76,39.39 0 top
U2  USBLC6-2SC6  [SOT23-6L]  11.16,51.63 90 top
U3  74HC595  [TSSOP16']  115.36,54.02 180 top
U4  LD1117S33  [SOT223]  28.7,22.88 270 top
U5  ATSAMD21G-A  [TQFP-48]  20.32,48.28 180 top
U6  [HTSSOP28_VIA]  49.53,74.95 0 top
U7  [HTSSOP28_VIA]  67.31,74.95 0 top
U8  [HTSSOP28_VIA]  85.09,74.95 0 top
U9  [HTSSOP28_VIA]  102.87,74.95 0 top
U10  [HTSSOP28_VIA]  102.87,25.42 180 top
U11  [HTSSOP28_VIA]  85.09,25.42 180 top
U12  [HTSSOP28_VIA]  67.31,25.42 180 top
U13  [HTSSOP28_VIA]  49.53,25.42 180 top
U$1  [WEEE_13MM]  87.63,20.34 90 bottom
U$2  [STEP800_LOGO_L_16MM]  117.4,24.92 90 top
U$3  [CE_5MM]  104.14,20.34 90 bottom
U$4  [PONOOR_LOGO_6MM]  115.57,22.88 90 bottom
U$5  [PONOOR_LOGO_6MM]  116,21.02 90 top
USB1  [USB-C_USB2.0-TYPE-C]  7,53.02 0 top
X1  CONN_02  [WJ25C-B-7.62-2P]  6.8,26.02 270 top
X2  25MHz  [CRYSTAL-3.2-2.5]  33.15,52.09 0 top
X3  RJ45_MAGNETICS_LED_HR871181A  [HR871181A]  8.89,73.68 90 top

## Tracks (layer width: path | path; a pad name or v marks a point on that pad's centre or on a via)
1V2O
  Top 0.2: IC1.22 27.77,57.96
  Top 0.254: 27.77,57.96 26.83,57.02 26.83,56.13 C23.2
3.3V  (via drill 0.3, 0.35, 0.6)
  Top 0.2: RN3.7 11.83,58.3 11.68,58.44 10.29,58.44 10.13,58.29 RN3.5
  Top 0.254: U5.44 21.07,41.65 C9.1 21.89,41.12 22.2,40.81 24.8,40.81 RN2.8 RN2.7 RN2.6 RN2.5 | U5.36 14.73,45.53 C13.1 15.11,44.81 v15.11,44.6 | U5.17 21.07,53.52 21.97,54.42 C12.1 | U5.6 27.23,48.03 C3.1 | 14.36,42.4 U1.16 | RN1.5 RN1.6 RN1.7 RN1.8 | U3.16 117.59,48.57 C7.1
  Top 0.305: RN3.8 RN3.7 | R5.2 v23.88,63.01 | C12.1 22.05,54.76 22.61,54.76 v22.73,54.89 | C3.1 27.48,49.43 28.11,50.06 28.83,50.06 v29.21,49.68 | C9.1 20.78,41.12 v20.77,41.11 | C31.2 40.18,57.51 v39.5,58.19 | RN2.5 33.15,41 | 33.15,41 RN1.8 | 14.36,42.4 14.27,42.4 13.63,43.04 C1.1 13.63,44.38 13.84,44.6 v15.11,44.6 | v33.27,40.03 33.27,40.88 33.15,41
  Top 0.406: Q3.4 39.37,56.37 C31.2 | RN3.5 9.15,58.57 v9.02,58.57 | SWD.P$1 36.83,46 37.97,44.85 37.97,41.68 37.3,41 RN1.5 | C7.1 118.11,47.48 118.11,45.11 v118.07,45.11 | v33.78,20.34 31.75,22.37 31.75,22.88 | J4.4 32.85,73.05 v34.25,71.65 | R12.2 R13.2 19.56,86.38 v21.72,84.22
  Top 0.508: v23.37,69.75 23.37,68.98 24,68.35 L1.1 | v39.5,71.4 38.35,71.4 37.21,70.25 L2.1
  Top 0.61: U4.2 31.75,22.88 U4.4
  Top 0.813: U4.2 23.75,22.88 C11.2 23.42,23.21 23.02,23.21 22.07,24.16 22.07,25.4 20.32,27.15 20.32,29.23 v19.94,29.61
  Route2 0.406: v118.07,45.11 118.11,45.06 118.11,20.34 109.22,11.45 41.91,11.45 33.78,19.58 v33.78,20.34
  Route15 0.254: v29.21,49.68 26.29,52.6 25.67,51.98 25.48,52.17 24.88,51.57 | v22.73,54.89 22.73,53.72 24.88,51.57 | v15.11,44.6 15.37,44.35 | v20.77,41.11 20.13,40.47 17.97,40.47 15.24,43.2 15.24,44.35 15.37,44.35 | 24.88,51.57 24.13,50.82 24.13,45.74 22.83,44.44 15.62,44.44 15.53,44.35 15.37,44.35 | v38.48,86.64 37.85,86 36.2,86 30.1,79.91 25.65,79.91 22.48,83.08 22.48,83.46 v21.72,84.22
  Route15 0.305: v23.88,63.01 22.23,63.01 | 22.23,63.01 20.07,63.01 18.29,64.79 18.29,66.57 19.3,67.59 21.46,69.75 v23.37,69.75 | v22.73,54.89 22.23,55.39 22.23,63.01 | v39.5,58.19 37.72,58.19 v29.21,49.68
  Route15 0.406: v21.72,84.22 22.61,83.33 22.61,70.51 v23.37,69.75 | v9.02,58.57 10.04,59.59 10.44,59.59 14.61,63.75 14.61,67.59 19.3,67.59 | J2.9 115.29,74.82 115.29,65.42 114.3,64.43 114.3,53.36 118.11,49.55 118.11,45.11 v118.07,45.11
  Route15 0.508: v23.37,69.75 24.77,71.14 33.74,71.14 v34.25,71.65 34.28,71.62 39.42,71.62 39.5,71.54 v39.5,71.4
  Route15 0.813: v19.94,29.61 19.94,29.63 20.95,30.64 20.95,40.92 v20.77,41.11
  Bottom 0.254: TP22.P$1 38.48,86.76 v38.48,86.64 | v34.25,71.65 33.74,71.14 R7.2 30.48,70.38 26.67,70.38 R6.2
  Bottom 0.305: J3.2 33.02,72.88 v34.25,71.65 | TP12.P$1 31.75,38.5 v33.27,40.03
  pour Route15 (isolate 0.254, rank 3): 0,90.19 40.64,90.19 40.64,55.9 36.83,55.9 21.59,40.66 21.59,35.58 13.97,35.58 13.97,44.35 12.57,45.74 0,45.74
  pour Top (isolate 0.254, no thermals): 26.67,19.07 39.37,19.07 39.37,26.18 26.67,26.18
3V_1  (via drill 0.3, 0.35)
  Top 0.254: C32.1 48.55,70.63 U6.6 | 52.83,76.73 52.45,77.11 U6.17 | 57.02,70.29 57.12,70.29 RN6.1 RN6.2
  Top 0.305: C32.1 49.1,70.33 v49.15,70.38 | 52.83,76.73 54.99,76.73 C36.2 v58.01,75.84
  Top 0.406: v57.65,69.62 57.65,69.66 57.02,70.29
  Route2 0.305: 56.9,70.13 49.78,70.13 49.53,70.38 v49.15,70.38 | v58.01,75.84 58.52,75.33 58.52,71.75 56.9,70.13 | v57.65,69.62 57.41,69.62 56.9,70.13
3V_2  (via drill 0.3, 0.35)
  Top 0.254: C33.1 66.33,70.63 U7.6 | 70.48,76.86 70.23,77.11 U7.17
  Top 0.305: C33.1 66.88,70.33 v66.93,70.38 | 70.48,76.86 72.64,76.86 C37.2 75.15,74.35 v75.15,73.05 | 58.8,70.67 59.35,70.67
  Top 0.406: 58.8,70.67 58.8,70.65 | v59.18,69.62 58.8,70 58.8,70.65 | RN6.3 58.8,70.65 | 59.35,70.67 RN6.4
  Route2 0.305: v75.15,73.05 75.15,72.64 72.9,70.38 v66.93,70.38 59.95,70.38 v59.18,69.62
3V_3  (via drill 0.3)
  Top 0.254: C34.1 84.11,70.63 U8.6 | RN7.1 92.71,70.67 | 92.71,70.67 RN7.2 | U8.17 88.02,77.11 88.27,76.86 90.42,76.86 C38.2 | v93.22,69.36 92.71,69.87 92.71,70.67
  Top 0.305: C34.1 84.66,70.33 v84.71,70.38 | v93.57,75.21 93.57,75.24 92.96,75.84 C38.2
  Route2 0.254: 92.33,70.13 92.46,70.13 v93.22,69.36
  Route2 0.305: v84.71,70.38 84.96,70.13 92.33,70.13 94.08,71.87 94.08,74.7 | v93.57,75.21 93.9,74.87 94.08,74.7 | 94.08,74.7
3V_4  (via drill 0.3, 0.35)
  Top 0.254: C35.1 101.89,70.63 U9.6 | 106.05,76.86 105.8,77.11 U9.17
  Top 0.305: C35.1 102.44,70.33 v102.49,70.38 | 106.05,76.86 108.2,76.86 C39.2 110.11,74.95 v110.59,74.95 | RN7.3 RN7.4 95.28,69.78 94.86,69.36 v94.11,69.36
  Route2 0.305: v110.59,74.95 109.6,73.97 109.6,71.52 108.46,70.38 v102.49,70.38 95.12,70.38 v94.11,69.36
3V_5  (via drill 0.3, 0.35)
  Top 0.254: C72.1 103.84,29.75 U10.6 | RN8.2 RN8.1 95.28,30.5 v94.77,31.01 | U10.17 99.94,23.39 99.82,23.52 97.54,23.52 C76.2
  Top 0.305: C72.1 103.3,30.04 v103.25,29.99 | C76.2 96.27,24.53 v94.81,25.99
  Route2 0.254: v94.81,25.99 94.71,26.09 94.24,26.09 93.75,26.57 93.75,28.88 95.33,30.45
  Route2 0.305: v103.25,29.99 102.62,29.99 102.36,30.25 95.53,30.25 95.33,30.45 v94.77,31.01
3V_6  (via drill 0.3, 0.35)
  Top 0.254: C73.1 86.06,29.75 U11.6 | U11.17 82.17,23.27 81.92,23.52 79.76,23.52 C77.2
  Top 0.305: C73.1 85.52,30.04 v85.47,29.99 | v77.63,28.72 77.63,25.65 C77.2 | RN8.3 RN8.4 92.68,30.59 92.84,30.75 92.84,30.76 v93.09,31.01
  Route2 0.305: v77.63,28.72 78.23,28.72 79.5,29.99 v85.47,29.99 85.6,29.87 92.33,29.87 93.09,30.63 v93.09,31.01
3V_7  (via drill 0.3)
  Top 0.254: C74.1 68.28,29.75 U12.6 | RN9.2 RN9.1 59.72,30.88 v59.59,31.01 | U12.17 64.39,23.27 64.14,23.52 61.98,23.52 C78.2 60.83,24.41 59.82,24.41 v58.8,25.42
  Top 0.305: C74.1 67.77,30.04 v67.69,30.12
  Route2 0.254: v59.59,31.01 59.59,28.98 58.04,27.42 58.04,26.18 v58.8,25.42
  Route2 0.305: v67.69,30.12 60.44,30.12 59.59,30.97 v59.59,31.01
3V_8  (via drill 0.3, 0.35)
  Top 0.254: C75.1 50.51,29.75 U13.6 | U13.17 46.6,23.27 46.35,23.52 44.2,23.52 C79.2
  Top 0.305: C75.1 49.96,30.04 v49.91,29.99 | C79.2 42.58,24.53 41.43,25.68 v41.43,26.06 | RN9.3 RN9.4 57.12,30.81 v57.19,30.88
  Route2 0.305: v41.43,26.06 41.43,27.48 43.94,29.99 v49.91,29.99 56.3,29.99 v57.19,30.88
5V  (via drill 0.6)
  Top 0.254: U2.5 10.49,51.63 10.79,51.33 10.79,50.19 10.54,49.93 8.76,49.93 8.38,50.31
  Top 0.406: USB1.A4_B9 8.35,55.42 v8.38,55.39 | v8.37,50.18 8.37,50.31 | 8.37,50.31 8.38,50.31 | USB1.B4_A9 8.05,50.62 8.37,50.31
  Top 0.61: 38.61,19.07 24.13,19.07 23.7,19.5 C8.1 23.73,20.57 U4.3
  Top 0.813: 43.81,49.55 42.8,49.55 42.81,49.57 42.7,49.57 39.86,46.73 39.86,41.44 41.27,40.03 41.27,27.58 39.62,25.93 C6.2 38.61,16.66 38.61,19.07 v38.61,19.83 | 77.22,49.55 92.71,49.55 | 92.71,49.55 94.87,49.55 | 94.87,49.55 107.95,49.55 111.76,45.74 111.76,35.58 109.24,33.06 CN13.3 | 92.71,49.55 92.71,40.4 93.27,39.84 93.27,34.91 CN14.3 | CN15.3 75.44,34.86 75.44,48.92 75.18,48.92 | CN6.3 59.44,65.77 v59.44,57.55 | CN7.3 77.22,65.77 77.22,49.55 | CN8.3 94.87,65.64 94.87,49.55 | CN5.3 41.27,65.39 41.27,59.71 43.81,57.17 43.81,49.55 | 75.18,48.92 57.78,48.92 57.15,49.55 | 57.15,49.55 54.61,49.55 | 54.61,49.55 43.81,49.55 | CN16.3 57.19,33.08 58.42,34.31 58.42,40.66 57.15,41.93 57.15,49.55 | 75.18,48.92 75.82,49.55 77.22,49.55 | v55.37,51.71 55.37,50.31 54.61,49.55
  Top 1.016: PS1.3 35.18,13.23 37.59,15.64 C6.2
  Route2 0.406: v8.38,55.39 8.38,50.19 v8.37,50.18
  Route2 0.508: v8.38,55.39 7.86,55.92 7.86,57.7 2.54,63.02 2.54,80.28 3.75,81.49 5.27,81.49 8.89,85.11 22.1,85.11 25.15,82.06 v25.27,82.19
  Route2 0.61: v38.61,19.83 36.83,21.61 31.5,21.61 14.73,38.38 14.73,43.14 13.91,43.96 13.91,44.64 v8.37,50.18
  Route2 0.813: v59.44,57.55 57.55,55.66 57.55,53.52 55.74,51.71 v55.37,51.71
  Bottom 0.508: v25.27,82.19 22.86,79.78 J3.6
32V  (via drill 0.3, 0.35, 0.8)
  Top 0.254: C52.2 45.47,70.63 45.95,71.12 U6.2 | C64.2 46.6,78.64 U6.26 | C56.2 52.45,71.27 U6.12 | C60.2 53.85,79.4 53.1,78.65 U6.16 | v56.39,57.81 56.32,57.74 C48.+ | C53.2 63.37,70.63 63.73,71 U7.2 | C66.2 64.39,78.64 U7.26 | C57.2 70.23,71.27 U7.12 | C61.2 71.63,79.27 71.23,78.87 71.21,78.87 70.89,78.55 U7.16 | v74.17,57.81 74.1,57.74 C49.+ | C54.2 80.9,70.63 81.52,71.25 U8.2 | C68.2 82.17,78.64 U8.26 | C58.2 88.02,71.27 U8.12 | C62.2 89.41,79.27 89.01,78.87 88.99,78.87 88.67,78.55 U8.16 | v91.95,57.81 91.88,57.74 C50.+ | C55.2 98.68,70.63 99.3,71.25 U9.2 | C70.2 99.94,78.64 U9.26 | C59.2 105.8,71.27 U9.12 | C63.2 107.19,79.27 106.79,78.87 106.77,78.87 106.44,78.55 U9.16 | v109.73,57.81 109.66,57.74 C51.+ | C92.2 107.06,29.74 106.44,29.12 U10.2 | C104.2 105.8,21.74 U10.26 | C96.2 99.94,29.11 U10.12 | C100.2 98.55,21.1 98.95,21.5 98.97,21.5 99.3,21.82 U10.16 | v96.01,42.57 96.08,42.64 C88.+ | C93.2 89.15,29.74 88.67,29.25 U11.2 | C106.2 88.02,21.74 U11.26 | C97.2 82.17,29.11 U11.12 | C101.2 80.77,21.1 81.17,21.5 81.19,21.5 81.52,21.82 U11.16 | v78.23,42.57 78.3,42.64 C89.+ | C94.2 71.5,29.74 70.89,29.12 U12.2 | C108.2 70.23,21.74 U12.26 | C98.2 64.39,29.11 U12.12 | C102.2 62.99,21.1 63.39,21.5 63.41,21.5 63.73,21.82 U12.16 | v60.45,42.57 60.52,42.64 C90.+ | C95.2 53.59,29.74 53.1,29.25 U13.2 | C110.2 52.45,21.74 U13.26 | C99.2 46.6,29.11 U13.12 | C103.2 45.21,21.1 45.61,21.5 45.63,21.5 45.95,21.82 U13.16 | v42.67,42.57 42.74,42.64 C91.+ | Q1.2 19.53,15.26 v20.32,15.26 | 69.41,61.73 69.41,61.94 69.09,62.25
  Top 0.305: D14.1 51.23,63.69 51.31,63.67 C65.2 51.63,62.11 v51.63,59.78 | v53.59,54 v53.59,55.27 53.72,55.27 v54.99,54 | v54.99,54 v56.39,54 | v53.59,57.81 v54.99,57.81 v56.39,57.81 v57.78,57.81 | C67.2 69.09,62.25 69.09,63.51 68.88,63.56 68.9,63.58 D15.1 | v71.37,54 v72.77,54 v74.17,54 | v74.17,54 v75.56,54 | v71.37,57.81 v72.77,57.81 v74.17,57.81 v75.56,57.81 | v69.41,59.78 69.41,61.73 | v89.15,54 v90.55,54 v91.95,54 | v91.95,54 v93.34,54 | v89.15,57.81 v90.55,57.81 v91.95,57.81 v93.34,57.81 | D17.1 104.46,62.13 C71.2 104.66,62.11 104.71,62.11 104.71,60.03 v104.97,59.78 | v106.93,54 v108.33,54 v109.73,54 | v109.73,54 v111.12,54 | v106.93,57.81 v108.33,57.81 v109.73,57.81 v111.12,57.81 | D26.1 101.1,36.76 101.09,36.73 C105.2 100.9,38.27 100.9,40.47 v100.78,40.6 | v98.81,46.38 v97.41,46.38 v96.01,46.38 | v96.01,46.38 v94.61,46.38 | v98.81,42.57 v97.41,42.57 v96.01,42.57 v94.61,42.57 | D27.1 83.32,36.76 83.31,36.74 C107.2 83.12,38.25 83.12,40.47 v83,40.6 | v81.03,46.38 v79.63,46.38 v78.23,46.38 v76.83,46.38 | v81.03,42.57 v79.63,42.57 v78.23,42.57 v76.83,42.57 | D28.1 65.63,36.58 65.61,36.56 65.53,36.58 C109.2 65.34,38.27 65.34,40.47 v65.22,40.6 | v63.25,46.38 v61.85,46.38 v60.45,46.38 | v60.45,46.38 v59.05,46.38 | v63.25,42.57 v61.85,42.57 v60.45,42.57 v59.05,42.57 | D29.1 47.76,36.76 47.75,36.74 C111.2 47.56,38.26 47.56,40.47 v47.43,40.6 | v45.47,46.38 v44.07,46.38 v42.67,46.38 v41.27,46.38 | v45.47,42.57 v44.07,42.57 v42.67,42.57 v41.27,42.57 | v91.95,54 91.88,54.07 C50.+ | C90.+ 60.52,46.31 v60.45,46.38 | v54.99,54 56.32,55.33 C48.+ | v74.17,54 74.1,54.07 C49.+ | v96.01,46.38 96.08,46.31 C88.+
  Top 0.305: v109.73,54 109.66,54.07 C51.+ | D16.1 86.68,62.31 C69.2 86.87,60.09 v87.19,59.78
  Top 0.406: D4.C v16.13,13.36 | v78.23,46.38 78.23,44.54 C89.+
  Top 0.61: C91.+ 42.74,46.31 v42.67,46.38
  Top 0.813: 21.97,15.64 v21.59,15.26
  Top 1.016: C64.2 v46.86,80.03 | C60.2 53.72,80.16 v52.45,80.16 | C52.2 v45.21,68.6 | C56.2 v53.85,68.6 | C66.2 v64.64,80.03 | C61.2 71.5,80.16 v70.23,80.16 | C53.2 v62.99,68.6 | C57.2 v71.63,68.6 | C68.2 v82.3,80.03 | C62.2 89.28,80.16 v88.01,80.16 | C54.2 v80.77,68.6 | C58.2 v89.41,68.6 | v100.08,79.91 98.68,79.91 C70.2 | C63.2 107.06,80.16 v105.79,80.16 | C55.2 v98.55,68.6 | C59.2 v107.19,68.6 | C104.2 v105.41,20.34 | C100.2 98.68,20.22 v99.95,20.22 | C92.2 v107.19,31.77 | C96.2 v98.55,31.77 | C106.2 v87.88,20.34 | C101.2 80.9,20.22 v82.17,20.22 | C93.2 v89.41,31.77 | C97.2 v80.77,31.77 | C108.2 70.48,20.34 70.36,20.47 v70.36,20.6 | C102.2 63.12,20.22 v64.39,20.22 | C94.2 v71.63,31.77 | C98.2 v62.99,31.77 | C110.2 v52.45,20.34 | C103.2 45.34,20.22 v46.61,20.22 | C95.2 v53.85,31.77 | C99.2 v45.21,31.77 | 21.97,15.64 C2.2 26.8,15.64 PS1.1
  Route15 0.254: v22.23,17.17 v21.59,17.17 v20.95,17.17 v20.32,17.17 19.94,17.55 v19.56,17.55 v18.8,17.55 18.41,17.55 v18.03,17.17 v17.4,17.17 v16.76,17.17 v16.13,17.17 v16.13,16.53 | v16.13,16.53 v16.76,16.53 v17.4,16.53 v18.03,16.53 18.41,16.91 v18.8,16.91 v19.56,16.91 19.94,16.91 v20.32,16.53 v20.95,16.53 v21.59,16.53 v21.59,15.9 | v16.13,15.9 v16.76,15.9 v17.4,15.9 v18.03,15.9 | v16.13,16.53 v16.13,15.9 | v16.13,15.9 v16.13,15.26 | v16.13,15.26 v16.76,15.26 v17.4,15.26 v18.03,15.26 | v16.13,15.26 v16.13,14.63 | v16.13,14.63 v16.76,14.63 v17.4,14.63 v18.03,14.63 18.41,14.63 v18.8,14.25 v19.56,14.25 19.94,14.25 v20.32,14.63 v20.95,14.63 v21.59,14.63 v21.59,15.26 | v20.32,15.26 v20.95,15.26 v21.59,15.26 | v20.32,15.9 v20.95,15.9 v21.59,15.9 | v16.13,14.63 v16.13,13.99 | v16.13,13.99 v16.76,13.99 v17.4,13.99 v18.03,13.99 18.41,13.99 v18.8,13.61 v19.56,13.61 19.94,13.61 v20.32,13.99 v20.95,13.99 v21.59,13.99 | v16.13,13.99 v16.13,13.36 | v16.13,13.36 v16.76,13.36 v17.4,13.36 v18.03,13.36 18.41,13.36 v18.8,12.98 v19.56,12.98 19.94,12.98 v20.32,13.36 v20.95,13.36 v21.59,13.36 v21.59,12.72 v20.95,12.72 v20.32,12.72 19.94,12.72 v19.56,12.34 v18.8,12.34 18.41,12.72 v18.03,12.72 v17.4,12.72 v16.76,12.72 v16.13,12.72 v16.13,13.36 | v21.59,15.26 v21.59,15.9
  Route15 0.508: 45.85,76.35 46.23,76.73 | v53.59,57.81 v51.63,59.78 47.37,64.03 47.37,66.82 46.99,66.82 v45.21,68.6 | v57.78,57.81 53.85,61.74 v53.85,68.6 | 63.63,76.35 64.01,76.73 | v71.37,57.81 v69.41,59.78 65.15,64.03 65.15,66.82 64.77,66.82 v62.99,68.6 | v75.56,57.81 71.63,61.74 v71.63,68.6 | 81.41,76.35 81.79,76.73 | v89.15,57.81 v87.19,59.78 82.93,64.03 82.93,66.82 82.55,66.82 v80.77,68.6 | v93.34,57.81 89.41,61.74 v89.41,68.6 | 99.19,76.35 99.57,76.73 | v106.93,57.81 v104.97,59.78 100.71,64.03 100.71,66.82 100.33,66.82 v98.55,68.6 | v111.12,57.81 107.19,61.74 v107.19,68.6 | 106.55,24.03 106.17,23.64 | v98.81,42.57 v100.78,40.6 105.03,36.34 105.03,33.55 105.41,33.55 v107.19,31.77 | v94.61,42.57 98.55,38.63 v98.55,31.77 | 88.77,24.03 88.39,23.64 | v81.03,42.57 v83,40.6 87.25,36.34 87.25,33.55 87.63,33.55 v89.41,31.77 | v76.83,42.57 80.77,38.63 v80.77,31.77 | 70.99,24.03 70.61,23.64 | v63.25,42.57 v65.22,40.6 69.47,36.34 69.47,33.55 69.85,33.55 v71.63,31.77 | v59.05,42.57 62.99,38.63 v62.99,31.77 | 53.21,24.03 52.83,23.64 | v45.47,42.57 v47.43,40.6 51.69,36.34 51.69,33.55 52.07,33.55 v53.85,31.77 | v41.27,42.57 45.21,38.63 v45.21,31.77
  Route15 0.61: v93.34,54 93.98,53.36 93.98,47.01 v94.61,46.38 | v98.81,46.38 98.81,48.66 104.14,54 v106.93,54 | v89.15,54 81.53,46.38 v81.03,46.38 | v76.83,46.38 75.56,47.65 v75.56,54 | v71.37,54 63.75,46.38 v63.25,46.38 | v59.05,46.38 56.39,49.04 v56.39,54 | v53.59,54 45.97,46.38 v45.47,46.38 | v41.27,46.38 37.8,42.91 37.33,42.91 30.48,36.06 30.48,25.42 v22.23,17.17
  Route15 2: v52.45,80.16 52.45,77.11 53.21,76.35 53.21,73.43 52.45,72.67 52.45,61.74 v56.39,57.81 | 46.23,76.73 46.86,77.37 v46.86,80.03 | 47.37,66.82 47.37,72.03 45.85,73.56 45.85,76.35 | v70.23,80.16 70.23,77.11 70.99,76.35 70.99,73.56 70.23,72.79 70.23,61.74 v74.17,57.81 | 64.01,76.73 64.64,77.37 v64.64,80.03 | 65.15,66.82 65.15,72.03 63.63,73.56 63.63,76.35 | v88.01,80.16 88.01,77.11 88.77,76.35 88.77,73.43 88.01,72.67 88.01,61.74 v91.95,57.81 | 81.79,76.73 82.3,77.24 v82.3,80.03 | 82.93,66.82 82.93,72.03 81.41,73.56 81.41,76.35 | v105.79,80.16 105.79,77.11 106.55,76.35 106.55,73.43 105.79,72.67 105.79,61.74 v109.73,57.81 | 99.57,76.73 100.08,77.24 v100.08,79.91 | 100.71,66.82 100.71,72.03 99.19,73.56 99.19,76.35 | v99.95,20.22 99.95,23.26 99.19,24.03 99.19,26.95 99.95,27.71 99.95,38.63 v96.01,42.57 | 106.17,23.64 105.41,22.88 v105.41,20.34 | 105.03,33.55 105.03,28.34 106.55,26.82 106.55,24.03 | v82.17,20.22 82.17,23.26 81.41,24.03 81.41,26.95 82.17,27.71 82.17,38.63 v78.23,42.57 | 88.39,23.64 87.88,23.14 v87.88,20.34 | 87.25,33.55 87.25,28.34 88.77,26.82 88.77,24.03 | v64.39,20.22 64.39,23.26 63.63,24.03 63.63,26.95 64.39,27.71 64.39,38.63 v60.45,42.57 | 70.61,23.64 70.36,23.39 v70.36,20.6 | 69.47,33.55 69.47,28.34 70.99,26.82 70.99,24.03 | v46.61,20.22 46.61,23.26 45.85,24.03 45.85,26.95 46.61,27.71 46.61,38.63 v42.67,42.57 | 52.83,23.64 52.45,23.26 v52.45,20.34 | 51.69,33.55 51.69,28.34 53.21,26.82 53.21,24.03
  pour Top (no thermals): 52.83,53.24 52.83,58.32 53.21,58.7 58.17,58.7 58.42,58.44 58.42,55.39 57.15,54.12 57.15,53.24
  pour Top (isolate 0.254, no thermals): 46.61,78.51 47.5,79.4 47.5,80.29 47.24,80.54 45.85,80.54 45.72,80.41 44.83,80.41 44.83,79.65 45.34,79.65 46.48,78.51
  pour Top (isolate 0.254, no thermals): 53.02,78.32 51.82,79.52 51.82,80.41 52.2,80.79 53.21,80.79 53.59,80.41 54.23,80.41 54.23,79.52
  pour Top (isolate 0.254, rank 2, no thermals): 45.85,71.52 44.83,70.51 44.83,69.49 45.59,69.49 46.35,70.25 46.35,71.27 46.1,71.52
  pour Top (isolate 0.254, rank 2, no thermals): 52.45,71.52 53.59,70.38 54.23,70.38 54.23,69.36 54.48,69.11 54.48,68.22 54.23,67.97 53.09,67.97 52.07,68.98 52.07,71.27 52.32,71.52
  pour Route15 (isolate 0.254, rank 2): 58.67,56.92 53.21,56.92 46.35,63.78 46.35,66.57 44.58,68.35 44.58,68.86 44.96,69.24 48.26,69.24 48.26,66.06 50.8,63.52 51.69,63.52 51.69,69.36 51.82,69.49 54.36,69.49 54.74,69.11 54.74,68.22 54.23,67.71 54.23,61.49 57.02,58.7 58.17,58.7 58.67,58.19
  pour Top (no thermals): 70.61,53.24 70.61,58.32 70.99,58.7 75.95,58.7 76.2,58.44 76.2,53.24
  pour Top (isolate 0.254, no thermals): 64.39,78.51 65.28,79.4 65.28,80.29 65.02,80.54 63.63,80.54 63.5,80.41 62.61,80.41 62.61,79.65 63.12,79.65 64.26,78.51
  pour Top (isolate 0.254, no thermals): 70.8,78.32 69.6,79.52 69.6,80.41 69.98,80.79 70.99,80.79 71.37,80.41 72.01,80.41 72.01,79.52
  pour Top (isolate 0.254, rank 2, no thermals): 63.63,71.52 62.61,70.51 62.61,69.49 63.37,69.49 64.14,70.25 64.14,71.27 63.88,71.52
  pour Top (isolate 0.254, rank 2, no thermals): 70.23,71.52 71.37,70.38 72.01,70.38 72.01,69.36 72.26,69.11 72.26,68.22 72.01,67.97 70.87,67.97 69.85,68.98 69.85,71.27 70.1,71.52
  pour Route15 (isolate 0.254, rank 2): 76.45,56.92 70.99,56.92 64.14,63.78 64.14,66.57 62.36,68.35 62.36,68.86 62.74,69.24 66.04,69.24 66.04,66.06 68.58,63.52 69.47,63.52 69.47,69.36 69.6,69.49 72.14,69.49 72.52,69.11 72.52,68.22 72.01,67.71 72.01,61.49 74.8,58.7 75.95,58.7 76.45,58.19
  pour Top (no thermals): 88.39,53.24 88.39,58.32 88.77,58.7 93.73,58.7 93.98,58.44 93.98,53.24
  pour Top (isolate 0.254, no thermals): 82.17,78.51 83.06,79.4 83.06,80.29 82.8,80.54 81.41,80.54 81.28,80.41 80.39,80.41 80.39,79.65 80.9,79.65 82.04,78.51
  pour Top (isolate 0.254, no thermals): 88.58,78.32 87.38,79.52 87.38,80.41 87.76,80.79 88.77,80.79 89.15,80.41 89.79,80.41 89.79,79.52
  pour Top (isolate 0.254, rank 2, no thermals): 81.41,71.52 80.39,70.51 80.39,69.49 81.15,69.49 81.92,70.25 81.92,71.27 81.66,71.52
  pour Top (isolate 0.254, rank 2, no thermals): 88.01,71.52 89.15,70.38 89.79,70.38 89.79,69.36 90.04,69.11 90.04,68.22 89.79,67.97 88.65,67.97 87.63,68.98 87.63,71.27 87.88,71.52
  pour Route15 (isolate 0.254, rank 2): 94.23,56.92 88.77,56.92 81.92,63.78 81.92,66.57 80.14,68.35 80.14,68.86 80.52,69.24 83.82,69.24 83.82,66.06 86.36,63.52 87.25,63.52 87.25,69.36 87.38,69.49 89.92,69.49 90.3,69.11 90.3,68.22 89.79,67.71 89.79,61.49 92.58,58.7 93.73,58.7 94.23,58.19
  pour Top (no thermals): 106.17,53.24 106.17,58.32 106.55,58.7 111.51,58.7 111.76,58.44 111.76,53.24
  pour Top (isolate 0.254, no thermals): 99.95,78.51 100.84,79.4 100.84,80.29 100.58,80.54 99.19,80.54 99.06,80.41 98.17,80.41 98.17,79.65 98.68,79.65 99.82,78.51
  pour Top (isolate 0.254, no thermals): 106.36,78.32 105.16,79.52 105.16,80.41 105.54,80.79 106.55,80.79 106.93,80.41 107.57,80.41 107.57,79.52
  pour Top (isolate 0.254, rank 2, no thermals): 99.19,71.52 98.17,70.51 98.17,69.49 98.93,69.49 99.69,70.25 99.69,71.27 99.44,71.52
  pour Top (isolate 0.254, rank 2, no thermals): 105.79,71.52 106.93,70.38 107.57,70.38 107.57,69.36 107.82,69.11 107.82,68.22 107.57,67.97 106.43,67.97 105.41,68.98 105.41,71.27 105.66,71.52
  pour Route15 (isolate 0.254, rank 2): 112.01,56.92 106.55,56.92 99.69,63.78 99.69,66.57 97.92,68.35 97.92,68.86 98.3,69.24 101.6,69.24 101.6,66.06 104.14,63.52 105.03,63.52 105.03,69.36 105.16,69.49 107.7,69.49 108.08,69.11 108.08,68.22 107.57,67.71 107.57,61.49 110.36,58.7 111.51,58.7 112.01,58.19
  pour Top (no thermals): 99.57,47.14 99.57,42.06 99.19,41.68 94.23,41.68 93.98,41.93 93.98,47.14
  pour Top (isolate 0.254, no thermals): 105.79,21.87 104.9,20.98 104.9,20.09 105.16,19.83 106.55,19.83 106.68,19.96 107.57,19.96 107.57,20.72 107.06,20.72 105.92,21.87
  pour Top (isolate 0.254, no thermals): 99.38,22.06 100.58,20.85 100.58,19.96 100.2,19.58 99.19,19.58 98.81,19.96 98.17,19.96 98.17,20.85
  pour Top (isolate 0.254, rank 2, no thermals): 106.55,28.85 107.57,29.87 107.57,30.88 106.81,30.88 106.05,30.12 106.05,29.11 106.3,28.85
  pour Top (isolate 0.254, rank 2, no thermals): 99.95,28.85 98.81,29.99 98.17,29.99 98.17,31.01 97.92,31.26 97.92,32.15 98.17,32.41 99.31,32.41 100.33,31.39 100.33,29.11 100.08,28.85
  pour Route15 (isolate 0.254, rank 2): 93.73,43.46 99.19,43.46 106.05,36.6 106.05,33.8 107.82,32.03 107.82,31.52 107.44,31.14 104.14,31.14 104.14,34.31 101.6,36.85 100.71,36.85 100.71,31.01 100.58,30.88 98.04,30.88 97.66,31.26 97.66,32.15 98.17,32.66 98.17,38.88 95.38,41.68 94.23,41.68 93.73,42.19
  pour Top (no thermals): 81.79,47.14 81.79,42.06 81.41,41.68 76.45,41.68 76.2,41.93 76.2,47.14
  pour Top (isolate 0.254, no thermals): 88.01,21.87 87.12,20.98 87.12,20.09 87.38,19.83 88.77,19.83 88.9,19.96 89.79,19.96 89.79,20.72 89.28,20.72 88.14,21.87
  pour Top (isolate 0.254, no thermals): 81.6,22.06 82.8,20.85 82.8,19.96 82.42,19.58 81.41,19.58 81.03,19.96 80.39,19.96 80.39,20.85
  pour Top (isolate 0.254, rank 2, no thermals): 88.77,28.85 89.79,29.87 89.79,30.88 89.03,30.88 88.27,30.12 88.27,29.11 88.52,28.85
  pour Top (isolate 0.254, rank 2, no thermals): 82.17,28.85 81.03,29.99 80.39,29.99 80.39,31.01 80.14,31.26 80.14,32.15 80.39,32.41 81.53,32.41 82.55,31.39 82.55,29.11 82.3,28.85
  pour Route15 (isolate 0.254, rank 2): 75.95,43.46 81.41,43.46 88.27,36.6 88.27,33.8 90.04,32.03 90.04,31.52 89.66,31.14 86.36,31.14 86.36,34.31 83.82,36.85 82.93,36.85 82.93,31.01 82.8,30.88 80.26,30.88 79.88,31.26 79.88,32.15 80.39,32.66 80.39,38.88 77.6,41.68 76.45,41.68 75.95,42.19
  pour Top (no thermals): 64.01,47.14 64.01,42.06 63.63,41.68 58.67,41.68 58.42,41.93 58.42,47.14
  pour Top (isolate 0.254, no thermals): 70.23,21.87 69.34,20.98 69.34,20.09 69.6,19.83 70.99,19.83 71.12,19.96 72.01,19.96 72.01,20.72 71.5,20.72 70.36,21.87
  pour Top (isolate 0.254, no thermals): 63.82,22.06 65.02,20.85 65.02,19.96 64.64,19.58 63.63,19.58 63.25,19.96 62.61,19.96 62.61,20.85
  pour Top (isolate 0.254, rank 2, no thermals): 70.99,28.85 72.01,29.87 72.01,30.88 71.25,30.88 70.48,30.12 70.48,29.11 70.74,28.85
  pour Top (isolate 0.254, rank 2, no thermals): 64.39,28.85 63.25,29.99 62.61,29.99 62.61,31.01 62.36,31.26 62.36,32.15 62.61,32.41 63.75,32.41 64.77,31.39 64.77,29.11 64.52,28.85
  pour Route15 (isolate 0.254, rank 2): 58.17,43.46 63.63,43.46 70.48,36.6 70.48,33.8 72.26,32.03 72.26,31.52 71.88,31.14 68.58,31.14 68.58,34.31 66.04,36.85 65.15,36.85 65.15,31.01 65.02,30.88 62.48,30.88 62.1,31.26 62.1,32.15 62.61,32.66 62.61,38.88 59.82,41.68 58.67,41.68 58.17,42.19
  pour Top (no thermals): 46.23,47.14 46.23,42.06 45.85,41.68 40.89,41.68 40.64,41.93 40.64,47.14
  pour Top (isolate 0.254, no thermals): 52.45,21.87 51.56,20.98 51.56,20.09 51.82,19.83 53.21,19.83 53.34,19.96 54.23,19.96 54.23,20.72 53.72,20.72 52.58,21.87
  pour Top (isolate 0.254, no thermals): 46.04,22.06 47.24,20.85 47.24,19.96 46.86,19.58 45.85,19.58 45.47,19.96 44.83,19.96 44.83,20.85
  pour Top (isolate 0.254, rank 2, no thermals): 53.21,28.85 54.23,29.87 54.23,30.88 53.47,30.88 52.7,30.12 52.7,29.11 52.96,28.85
  pour Top (isolate 0.254, rank 2, no thermals): 46.61,28.85 45.47,29.99 44.83,29.99 44.83,31.01 44.58,31.26 44.58,32.15 44.83,32.41 45.97,32.41 46.99,31.39 46.99,29.11 46.74,28.85
  pour Route15 (isolate 0.254, rank 2): 40.39,43.46 45.85,43.46 52.7,36.6 52.7,33.8 54.48,32.03 54.48,31.52 54.1,31.14 50.8,31.14 50.8,34.31 48.26,36.85 47.37,36.85 47.37,31.01 47.24,30.88 44.7,30.88 44.32,31.26 44.32,32.15 44.83,32.66 44.83,38.88 42.04,41.68 40.89,41.68 40.39,42.19
  pour Top (isolate 0.254, no thermals): 22.86,17.8 22.86,12.09 15.49,12.09 15.49,17.8
  pour Route15 (isolate 0.254, rank 4): -1.27,10.18 -1.27,17.8 17.4,17.8 21.59,21.99 21.59,40.03 36.83,55.27 113.03,55.27 113.03,45.11 50.16,45.11 43.81,38.76 43.81,29.87 40.64,26.69 40.64,10.18
  pour Bottom: 15.88,17.42 15.88,12.47 18.41,12.47 18.41,12.09 19.81,12.09 19.81,12.47 21.84,12.47 21.84,16.91 22.48,16.91 22.48,17.42 19.81,17.42 19.81,17.8 18.54,17.8 18.54,17.42
  pour Route2: 15.88,17.42 15.88,12.47 18.41,12.47 18.41,12.09 19.81,12.09 19.81,12.47 21.84,12.47 21.84,16.91 22.48,16.91 22.48,17.42 19.81,17.42 19.81,17.8 18.54,17.8 18.54,17.42
74HC165_CS  (via drill 0.3, 0.35)
  Top 0.254: U5.47 22.57,44.94 21.93,45.58 v20.61,45.58 | v17.2,38.76 16.95,38.51 14.73,38.51 14.44,38.21 U1.1 | v37.97,46.5 38.86,47.39 39.28,47.39 41.91,50.02 v41.91,50.82
  Top 0.305: v106.05,51.46 106.17,51.46 106.87,52.15 114.99,52.15 U3.12
  Route2 0.254: v17.2,38.76 19.1,40.66 19.1,42.55 20.61,44.06 v20.61,45.58 20.61,47.68 21.36,48.43 26.52,48.43 27.36,47.6 30.09,47.6 30.29,47.39 37.08,47.39 v37.97,46.5
  Route2 0.305: v106.05,51.46 105.16,50.57 42.16,50.57 v41.91,50.82
74HC165_MISO  (via drill 0.3, 0.35)
  Top 0.254: v22.75,47.01 22.88,47.14 22.88,47.95 22.57,48.26 U5.14 | v112.9,49.55 113.04,49.69 U3.9
  Route2 0.254: v38.23,36.73 36.32,36.73 34.67,38.38 24.95,38.38 23.42,39.91 23.42,40.1 22.36,41.17 22.36,46.62 v22.75,47.01
  Route15 0.254: v38.23,36.73 39.98,34.97 39.98,14.68 arc45 40.62,13.12 42.05,11.69 arc45 43.85,10.94 115.41,10.94 arc45 117.2,11.69 118.87,13.36 118.87,40.79 113.41,46.25 113.41,49.04 v112.9,49.55
74HC165_MOSI  (via drill 0.3, 0.35)
  Top 0.254: U5.23 18.07,51.29 v18.29,51.08 | U1.10 18.39,41.36 v18.5,41.26
  Route2 0.254: v18.5,41.26 18.5,42.65 19.18,43.33 19.18,46.76 v18.41,47.52
  Bottom 0.254: v18.41,47.52 18.41,48.82 17.93,49.3 17.93,50.69 18.29,51.05 v18.29,51.08
74HC165_SCK  (via drill 0.3, 0.35)
  Top 0.254: v17.67,38.01 15.51,38.01 15.14,37.64 U1.2 15.14,35.4 19.44,31.1 19.65,31.1 v19.68,31.13 | v21.34,47.52 21.57,47.75 U5.16 | v115.44,49.17 115.19,49.17 114.34,50.02 U3.11
  Route2 0.254: v17.67,38.01 17.97,38.31 17.97,38.81 19.66,40.5 19.66,41.16 21.34,42.84 v21.34,47.52 | v19.68,31.13 21.06,31.13 31.27,20.93 31.61,20.93 41.59,10.94 116.74,10.94 119,13.2 119,45.62 v115.44,49.17
!RESET  (via drill 0.3, 0.35)
  Top 0.254: U5.40 19.07,48.05 v19.94,48.92 | SWD.P$10 31.75,43.85 30.73,44.87 v30.73,48.17 | v17.65,53.87 17.65,54.89 17.78,55.01 17.78,57.68 17.69,57.77 17.69,58.46 17.05,59.1 RESET.P$1 RESET.P$2 21.07,58.61 v20.65,58.19
  Top 0.305: R5.1 22.99,61.36 22.99,60.47 v23.11,60.35
  Route2 0.254: v30.73,48.17 30.6,48.04 30.64,48 27.73,48 26.81,48.92 v19.94,48.92 | v23.11,60.35 21.41,58.65 21.22,58.65 20.77,58.19 v20.65,58.19
  Route2 0.305: v19.94,48.92 19.94,49.04 19.18,49.81 19.18,52.08 17.65,53.6 v17.65,53.87
  Bottom 0.254: TP5.P$1 30.48,47.92 v30.73,48.17
+3V3A  (via drill 0.3, 0.35)